# EAGLE schematic relay_matrix_16x8 (EAGLE 9.5.1)

## Sheet 1 of 6
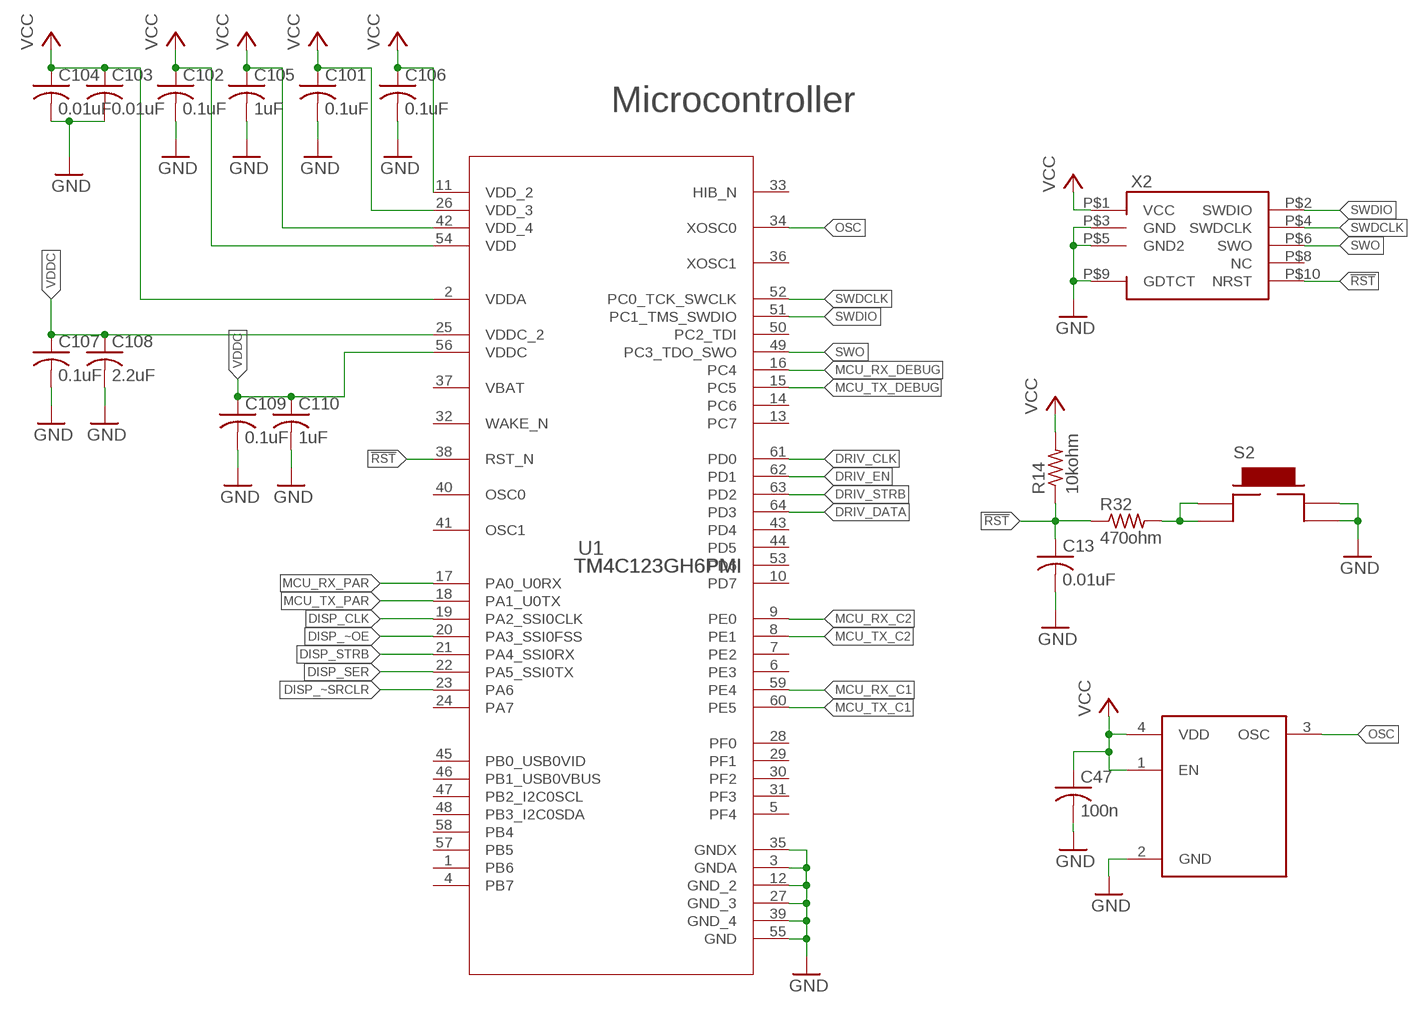
[diagram p0: schematic, sheet 1]

### Parts
C13  0.01uF  C-USC0402  [C0402]
C47  100n  C-USC0402  [C0402]
C101  0.1uF  C-USC0402  [C0402]
C102  0.1uF  C-USC0402  [C0402]
C103  0.01uF  C-USC0402  [C0402]
C104  0.01uF  C-USC0402  [C0402]
C105  1uF  C-USC0402  [C0402]
C106  0.1uF  C-USC0402  [C0402]
C107  0.1uF  C-USC0402  [C0402]
C108  2.2uF  C-USC0603  [C0603]
C109  0.1uF  C-USC0402  [C0402]
C110  1uF  C-USC0402  [C0402]
R14  10kohm  R-US_R0402  [R0402]
R32  470ohm  R-US_R0402  [R0402]
S2  TE_FSM4JSMA  [TE_FSMJSMA]
U1  TM4C123GH6PMI  [PM0064A_N]
U5  ECS-2033-080-AU  [OSCCC250X200X110N]
X2  FTSH-105-01-F-DV-007-K-P  [FTSH-105-01-F-DV-007-K-P]

### Nets
!RST: C13.1 R14.1 R32.1 U1.38(RST_N) X2.P$10(NRST)
DISP_CLK: U1.19(PA2_SSI0CLK) ; also sheet 5
DISP_SER: U1.22(PA5_SSI0TX) ; also sheet 5
DISP_STRB: U1.21(PA4_SSI0RX) ; also sheet 5
DISP_~OE: U1.20(PA3_SSI0FSS) ; also sheet 5
DISP_~SRCLR: U1.23(PA6) ; also sheet 5
DRIV_CLK: U1.61(PD0) ; also sheet 3
DRIV_DATA: U1.64(PD3) ; also sheet 3
DRIV_EN: U1.62(PD1) ; also sheet 3
DRIV_STRB: U1.63(PD2) ; also sheet 3
GND: C13.2 C47.2 C101.2 C102.2 C103.2 C104.2 C105.2 C106.2 C107.2 C108.2 C109.2 C110.2 S2.P$3 S2.P$4 U1.3(GNDA) U1.12(GND_2) U1.27(GND_3) U1.35(GNDX) U1.39(GND_4) U1.55(GND) U5.2(GND) X2.P$3(GND) X2.P$5(GND2) X2.P$9(GDTCT) ; also sheet 2,3,4,5
MCU_RX_C1: U1.59(PE4) ; also sheet 2
MCU_RX_C2: U1.9(PE0) ; also sheet 2
MCU_RX_DEBUG: U1.16(PC4) ; also sheet 2
MCU_RX_PAR: U1.17(PA0_U0RX) ; also sheet 2
MCU_TX_C1: U1.60(PE5) ; also sheet 2
MCU_TX_C2: U1.8(PE1) ; also sheet 2
MCU_TX_DEBUG: U1.15(PC5) ; also sheet 2
MCU_TX_PAR: U1.18(PA1_U0TX) ; also sheet 2
N$19: R32.2 S2.P$1 S2.P$2
OSC: U1.34(XOSC0) U5.3(OSC)
SWDCLK: U1.52(PC0_TCK_SWCLK) X2.P$4(SWDCLK)
SWDIO: U1.51(PC1_TMS_SWDIO) X2.P$2(SWDIO)
SWO: U1.49(PC3_TDO_SWO) X2.P$6(SWO)
VCC: C47.1 C101.1 C102.1 C103.1 C104.1 C105.1 C106.1 R14.2 U1.2(VDDA) U1.11(VDD_2) U1.26(VDD_3) U1.42(VDD_4) U1.54(VDD) U5.1(EN) U5.4(VDD) X2.P$1(VCC) ; also sheet 2,3,5
VDDC: C107.1 C108.1 C109.1 C110.1 U1.25(VDDC_2) U1.56(VDDC)
Unconnected: U1.1(PB6) U1.4(PB7) U1.5(PF4) U1.6(PE3) U1.7(PE2) U1.10(PD7) U1.13(PC7) U1.14(PC6) U1.24(PA7) U1.28(PF0) U1.29(PF1) U1.30(PF2) U1.31(PF3) U1.32(WAKE_N) U1.33(HIB_N) U1.36(XOSC1) U1.40(OSC0) U1.41(OSC1) U1.43(PD4) U1.44(PD5) U1.45(PB0_USB0VID) U1.46(PB1_USB0VBUS) U1.47(PB2_I2C0SCL) U1.48(PB3_I2C0SDA) U1.50(PC2_TDI) U1.53(PD6) U1.57(PB5) U1.58(PB4) X2.P$8(NC)

### Notes on the sheet
- Microcontroller

## Sheet 2 of 6
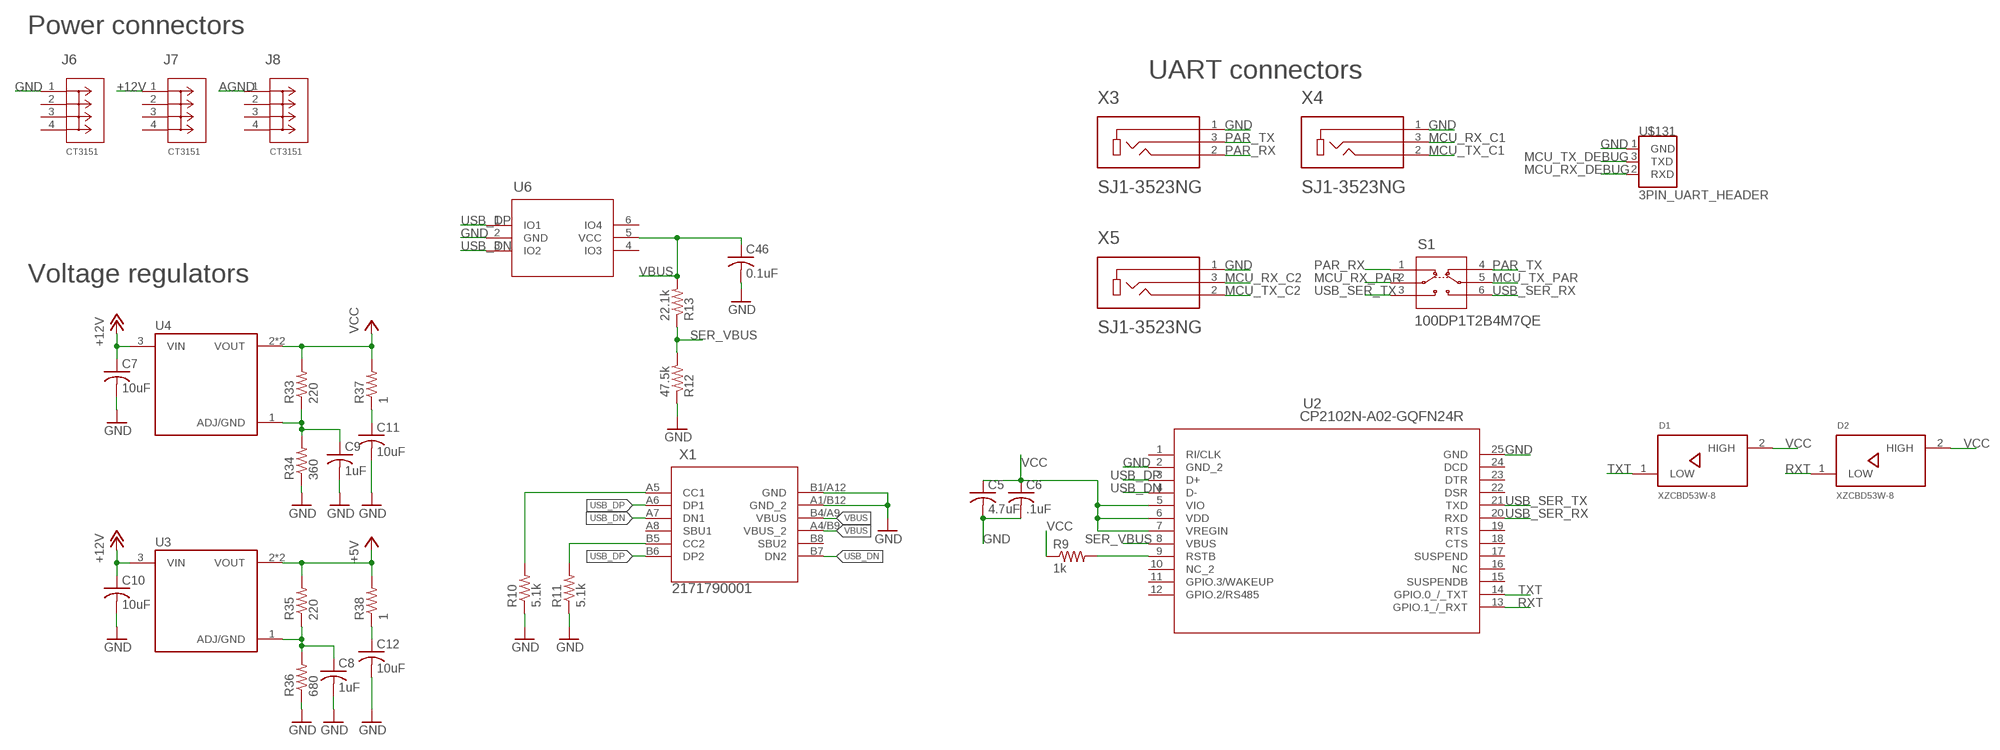
[diagram p1: schematic, sheet 2]

### Parts
C5  4.7uF  C-USC0603  [C0603]
C6  .1uF  C-USC0402  [C0402]
C7  10uF  C-USC0805  [C0805]
C8  1uF  C-USC0402  [C0402]
C9  1uF  C-USC0402  [C0402]
C10  10uF  C-USC0805  [C0805]
C11  10uF  C-USC0805  [C0805]
C12  10uF  C-USC0805  [C0805]
C46  0.1uF  C-USC0402  [C0402]
D1  XZCBD53W-8  [DIOC1608X70N]
D2  XZCBD53W-8  [DIOC1608X70N]
J6  CT3151  [CONN_CT3151]
J7  CT3151  [CONN_CT3151]
J8  CT3151  [CONN_CT3151]
R9  1k  R-US_R0402  [R0402]
R10  5.1k  R-US_R0402  [R0402]
R11  5.1k  R-US_R0402  [R0402]
R12  47.5k  R-US_R0402  [R0402]
R13  22.1k  R-US_R0402  [R0402]
R33  220  R-US_R0603  [R0603]
R34  360  R-US_R0603  [R0603]
R35  220  R-US_R0603  [R0603]
R36  680  R-US_R0603  [R0603]
R37  1  R-US_R0603  [R0603]
R38  1  R-US_R0603  [R0603]
S1  100DP1T2B4M7QE  [100DP1T2B4M7QE_EWI]
U2  CP2102N-A02-GQFN24R  [QFN24_SIL]
U3  NCP1117XXA  [TO230P990X240-4N]
U4  NCP1117XXA  [TO230P990X240-4N]
U6  TPD4E001RDBVR  [DBV6]
U$131  3PIN_UART_HEADER  [HDRV3W64P254_1X3_1016X277X854B]
X1  2171790001  [2171790001_MOL]
X3  SJ1-3523NG  [CUI_SJ1-3523NG]
X4  SJ1-3523NG  [CUI_SJ1-3523NG]
X5  SJ1-3523NG  [CUI_SJ1-3523NG]

### Nets
+5V: R35.2 R38.2 U3.2(VOUT) U3.4(VOUT) ; also sheet 3
+12V: C7.1 C10.1 J7.1 U3.3(VIN) U4.3(VIN)
AGND: J8.1 ; also sheet 6
GND: C5.2 C6.2 C7.2 C8.2 C9.2 C10.2 C11.2 C12.2 C46.2 J6.1 R10.1 R11.1 R12.1 R34.1 R36.1 U2.2(GND_2) U2.25(GND) U6.2(GND) U$131.1(GND) X1.A1/B12(GND_2) X1.B1/A12(GND) X3.1 X4.1 X5.1 ; also sheet 1,3,4,5
MCU_RX_C1: X4.3 ; also sheet 1
MCU_RX_C2: X5.3 ; also sheet 1
MCU_RX_DEBUG: U$131.2(RXD) ; also sheet 1
MCU_RX_PAR: S1.2 ; also sheet 1
MCU_TX_C1: X4.2 ; also sheet 1
MCU_TX_C2: X5.2 ; also sheet 1
MCU_TX_DEBUG: U$131.3(TXD) ; also sheet 1
MCU_TX_PAR: S1.5 ; also sheet 1
N$1: R9.2 U2.9(RSTB)
N$4: R10.2 X1.A5(CC1)
N$5: R11.2 X1.B5(CC2)
N$20: C9.1 R33.1 R34.2 U4.1(ADJ/GND)
N$21: C8.1 R35.1 R36.2 U3.1(ADJ/GND)
N$22: C11.1 R37.1
N$23: C12.1 R38.1
PAR_RX: S1.1 X3.2
PAR_TX: S1.4 X3.3
RXT: D2.1(LOW) U2.13(GPIO.1_/_RXT)
SER_VBUS: R12.2 R13.1 U2.8(VBUS)
TXT: D1.1(LOW) U2.14(GPIO.0_/_TXT)
USB_DN: U2.4(D-) U6.3(IO2) X1.A7(DN1) X1.B7(DN2)
USB_DP: U2.3(D+) U6.1(IO1) X1.A6(DP1) X1.B6(DP2)
USB_SER_RX: S1.6 U2.20(RXD)
USB_SER_TX: S1.3 U2.21(TXD)
VBUS: C46.1 R13.2 U6.5(VCC) X1.A4/B9(VBUS_2) X1.B4/A9(VBUS)
VCC: C5.1 C6.1 D1.2(HIGH) D2.2(HIGH) R9.1 R33.2 R37.2 U2.5(VIO) U2.6(VDD) U2.7(VREGIN) U4.2(VOUT) U4.4(VOUT) ; also sheet 1,3,5
Unconnected: J6.2 J6.3 J6.4 J7.2 J7.3 J7.4 J8.2 J8.3 J8.4 U2.1(RI/CLK) U2.10(NC_2) U2.11(GPIO.3/WAKEUP) U2.12(GPIO.2/RS485) U2.15(SUSPENDB) U2.16(NC) U2.17(SUSPEND) U2.18(CTS) U2.19(RTS) U2.22(DSR) U2.23(DTR) U2.24(DCD) U6.4(IO3) U6.6(IO4) X1.A8(SBU1) X1.B8(SBU2)

### Notes on the sheet
- Power connectors
- UART connectors
- Voltage regulators

## Sheet 3 of 6
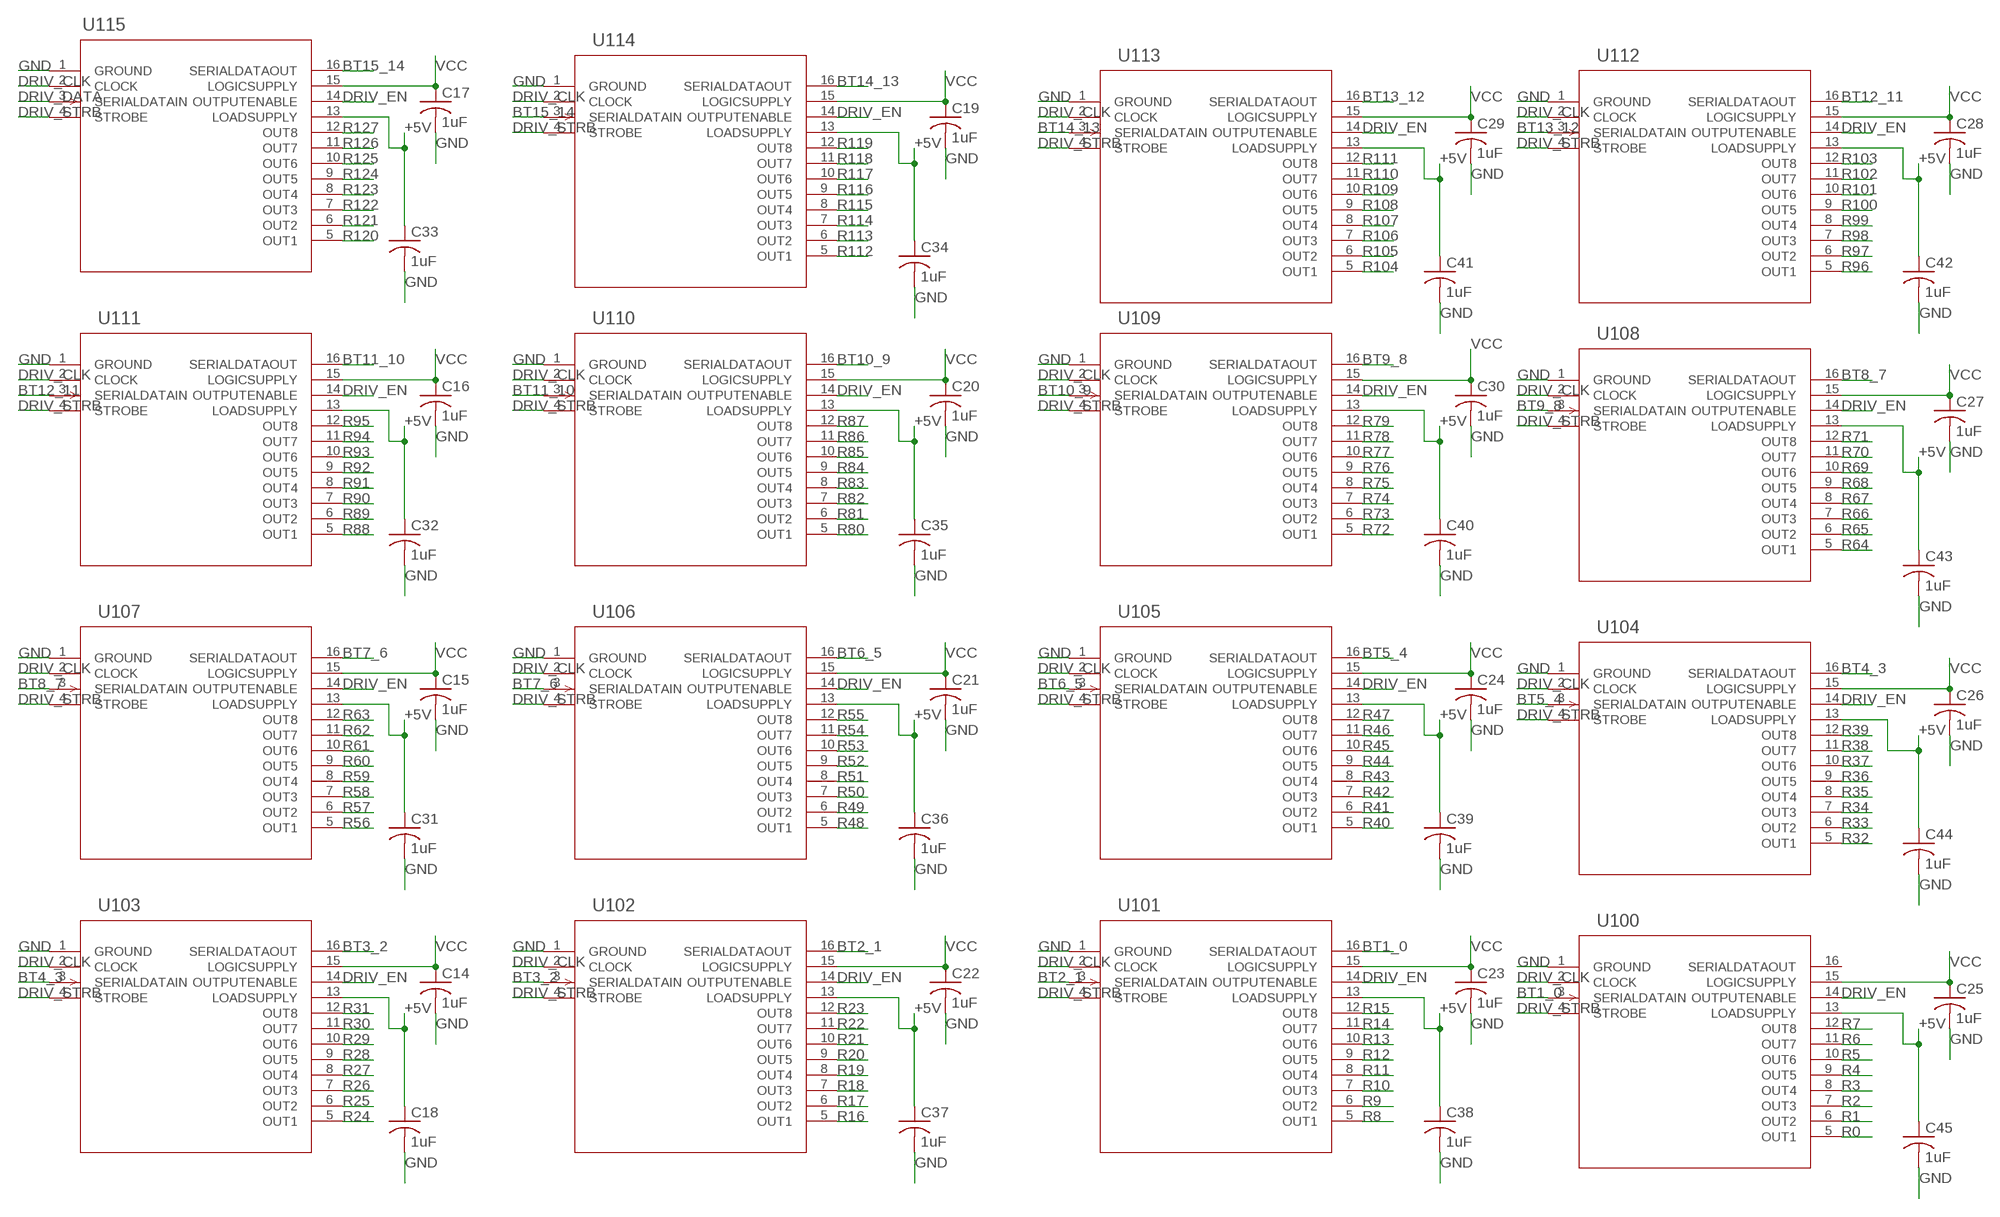
[diagram p2: schematic, sheet 3]

### Parts
C14  1uF  C-USC0402  [C0402]
C15  1uF  C-USC0402  [C0402]
C16  1uF  C-USC0402  [C0402]
C17  1uF  C-USC0402  [C0402]
C18  1uF  C-USC0402  [C0402]
C19  1uF  C-USC0402  [C0402]
C20  1uF  C-USC0402  [C0402]
C21  1uF  C-USC0402  [C0402]
C22  1uF  C-USC0402  [C0402]
C23  1uF  C-USC0402  [C0402]
C24  1uF  C-USC0402  [C0402]
C25  1uF  C-USC0402  [C0402]
C26  1uF  C-USC0402  [C0402]
C27  1uF  C-USC0402  [C0402]
C28  1uF  C-USC0402  [C0402]
C29  1uF  C-USC0402  [C0402]
C30  1uF  C-USC0402  [C0402]
C31  1uF  C-USC0402  [C0402]
C32  1uF  C-USC0402  [C0402]
C33  1uF  C-USC0402  [C0402]
C34  1uF  C-USC0402  [C0402]
C35  1uF  C-USC0402  [C0402]
C36  1uF  C-USC0402  [C0402]
C37  1uF  C-USC0402  [C0402]
C38  1uF  C-USC0402  [C0402]
C39  1uF  C-USC0402  [C0402]
C40  1uF  C-USC0402  [C0402]
C41  1uF  C-USC0402  [C0402]
C42  1uF  C-USC0402  [C0402]
C43  1uF  C-USC0402  [C0402]
C44  1uF  C-USC0402  [C0402]
C45  1uF  C-USC0402  [C0402]
U100  MIC5891YWM-TR  [SOIC-16_WM_MCH]
U101  MIC5891YWM-TR  [SOIC-16_WM_MCH]
U102  MIC5891YWM-TR  [SOIC-16_WM_MCH]
U103  MIC5891YWM-TR  [SOIC-16_WM_MCH]
U104  MIC5891YWM-TR  [SOIC-16_WM_MCH]
U105  MIC5891YWM-TR  [SOIC-16_WM_MCH]
U106  MIC5891YWM-TR  [SOIC-16_WM_MCH]
U107  MIC5891YWM-TR  [SOIC-16_WM_MCH]
U108  MIC5891YWM-TR  [SOIC-16_WM_MCH]
U109  MIC5891YWM-TR  [SOIC-16_WM_MCH]
U110  MIC5891YWM-TR  [SOIC-16_WM_MCH]
U111  MIC5891YWM-TR  [SOIC-16_WM_MCH]
U112  MIC5891YWM-TR  [SOIC-16_WM_MCH]
U113  MIC5891YWM-TR  [SOIC-16_WM_MCH]
U114  MIC5891YWM-TR  [SOIC-16_WM_MCH]
U115  MIC5891YWM-TR  [SOIC-16_WM_MCH]

### Nets
+5V: C18.1 C31.1 C32.1 C33.1 C34.1 C35.1 C36.1 C37.1 C38.1 C39.1 C40.1 C41.1 C42.1 C43.1 C44.1 C45.1 U100.13(LOADSUPPLY) U101.13(LOADSUPPLY) U102.13(LOADSUPPLY) U103.13(LOADSUPPLY) U104.13(LOADSUPPLY) U105.13(LOADSUPPLY) U106.13(LOADSUPPLY) U107.13(LOADSUPPLY) U108.13(LOADSUPPLY) U109.13(LOADSUPPLY) U110.13(LOADSUPPLY) U111.13(LOADSUPPLY) U112.13(LOADSUPPLY) U113.13(LOADSUPPLY) U114.13(LOADSUPPLY) U115.13(LOADSUPPLY) ; also sheet 2
BT1_0: U100.3(SERIALDATAIN) U101.16(SERIALDATAOUT)
BT2_1: U101.3(SERIALDATAIN) U102.16(SERIALDATAOUT)
BT3_2: U102.3(SERIALDATAIN) U103.16(SERIALDATAOUT)
BT4_3: U103.3(SERIALDATAIN) U104.16(SERIALDATAOUT)
BT5_4: U104.3(SERIALDATAIN) U105.16(SERIALDATAOUT)
BT6_5: U105.3(SERIALDATAIN) U106.16(SERIALDATAOUT)
BT7_6: U106.3(SERIALDATAIN) U107.16(SERIALDATAOUT)
BT8_7: U107.3(SERIALDATAIN) U108.16(SERIALDATAOUT)
BT9_8: U108.3(SERIALDATAIN) U109.16(SERIALDATAOUT)
BT10_9: U109.3(SERIALDATAIN) U110.16(SERIALDATAOUT)
BT11_10: U110.3(SERIALDATAIN) U111.16(SERIALDATAOUT)
BT12_11: U111.3(SERIALDATAIN) U112.16(SERIALDATAOUT)
BT13_12: U112.3(SERIALDATAIN) U113.16(SERIALDATAOUT)
BT14_13: U113.3(SERIALDATAIN) U114.16(SERIALDATAOUT)
BT15_14: U114.3(SERIALDATAIN) U115.16(SERIALDATAOUT)
DRIV_CLK: U100.2(CLOCK) U101.2(CLOCK) U102.2(CLOCK) U103.2(CLOCK) U104.2(CLOCK) U105.2(CLOCK) U106.2(CLOCK) U107.2(CLOCK) U108.2(CLOCK) U109.2(CLOCK) U110.2(CLOCK) U111.2(CLOCK) U112.2(CLOCK) U113.2(CLOCK) U114.2(CLOCK) U115.2(CLOCK) ; also sheet 1
DRIV_DATA: U115.3(SERIALDATAIN) ; also sheet 1
DRIV_EN: U100.14(OUTPUTENABLE) U101.14(OUTPUTENABLE) U102.14(OUTPUTENABLE) U103.14(OUTPUTENABLE) U104.14(OUTPUTENABLE) U105.14(OUTPUTENABLE) U106.14(OUTPUTENABLE) U107.14(OUTPUTENABLE) U108.14(OUTPUTENABLE) U109.14(OUTPUTENABLE) U110.14(OUTPUTENABLE) U111.14(OUTPUTENABLE) U112.14(OUTPUTENABLE) U113.14(OUTPUTENABLE) U114.14(OUTPUTENABLE) U115.14(OUTPUTENABLE) ; also sheet 1
DRIV_STRB: U100.4(STROBE) U101.4(STROBE) U102.4(STROBE) U103.4(STROBE) U104.4(STROBE) U105.4(STROBE) U106.4(STROBE) U107.4(STROBE) U108.4(STROBE) U109.4(STROBE) U110.4(STROBE) U111.4(STROBE) U112.4(STROBE) U113.4(STROBE) U114.4(STROBE) U115.4(STROBE) ; also sheet 1
GND: C14.2 C15.2 C16.2 C17.2 C18.2 C19.2 C20.2 C21.2 C22.2 C23.2 C24.2 C25.2 C26.2 C27.2 C28.2 C29.2 C30.2 C31.2 C32.2 C33.2 C34.2 C35.2 C36.2 C37.2 C38.2 C39.2 C40.2 C41.2 C42.2 C43.2 C44.2 C45.2 U100.1(GROUND) U101.1(GROUND) U102.1(GROUND) U103.1(GROUND) U104.1(GROUND) U105.1(GROUND) U106.1(GROUND) U107.1(GROUND) U108.1(GROUND) U109.1(GROUND) U110.1(GROUND) U111.1(GROUND) U112.1(GROUND) U113.1(GROUND) U114.1(GROUND) U115.1(GROUND) ; also sheet 1,2,4,5
R0: U100.5(OUT1) ; also sheet 4
R1: U100.6(OUT2) ; also sheet 4
R2: U100.7(OUT3) ; also sheet 4
R3: U100.8(OUT4) ; also sheet 4
R4: U100.9(OUT5) ; also sheet 4
R5: U100.10(OUT6) ; also sheet 4
R6: U100.11(OUT7) ; also sheet 4
R7: U100.12(OUT8) ; also sheet 4
R8: U101.5(OUT1) ; also sheet 4
R9: U101.6(OUT2) ; also sheet 4
R10: U101.7(OUT3) ; also sheet 4
R11: U101.8(OUT4) ; also sheet 4
R12: U101.9(OUT5) ; also sheet 4
R13: U101.10(OUT6) ; also sheet 4
R14: U101.11(OUT7) ; also sheet 4
R15: U101.12(OUT8) ; also sheet 4
R16: U102.5(OUT1) ; also sheet 4
R17: U102.6(OUT2) ; also sheet 4
R18: U102.7(OUT3) ; also sheet 4
R19: U102.8(OUT4) ; also sheet 4
R20: U102.9(OUT5) ; also sheet 4
R21: U102.10(OUT6) ; also sheet 4
R22: U102.11(OUT7) ; also sheet 4
R23: U102.12(OUT8) ; also sheet 4
R24: U103.5(OUT1) ; also sheet 4
R25: U103.6(OUT2) ; also sheet 4
R26: U103.7(OUT3) ; also sheet 4
R27: U103.8(OUT4) ; also sheet 4
R28: U103.9(OUT5) ; also sheet 4
R29: U103.10(OUT6) ; also sheet 4
R30: U103.11(OUT7) ; also sheet 4
R31: U103.12(OUT8) ; also sheet 4
R32: U104.5(OUT1) ; also sheet 4
R33: U104.6(OUT2) ; also sheet 4
R34: U104.7(OUT3) ; also sheet 4
R35: U104.8(OUT4) ; also sheet 4
R36: U104.9(OUT5) ; also sheet 4
R37: U104.10(OUT6) ; also sheet 4
R38: U104.11(OUT7) ; also sheet 4
R39: U104.12(OUT8) ; also sheet 4
R40: U105.5(OUT1) ; also sheet 4
R41: U105.6(OUT2) ; also sheet 4
R42: U105.7(OUT3) ; also sheet 4
R43: U105.8(OUT4) ; also sheet 4
R44: U105.9(OUT5) ; also sheet 4
R45: U105.10(OUT6) ; also sheet 4
R46: U105.11(OUT7) ; also sheet 4
R47: U105.12(OUT8) ; also sheet 4
R48: U106.5(OUT1) ; also sheet 4
R49: U106.6(OUT2) ; also sheet 4
R50: U106.7(OUT3) ; also sheet 4
R51: U106.8(OUT4) ; also sheet 4
R52: U106.9(OUT5) ; also sheet 4
R53: U106.10(OUT6) ; also sheet 4
R54: U106.11(OUT7) ; also sheet 4
R55: U106.12(OUT8) ; also sheet 4
R56: U107.5(OUT1) ; also sheet 4
R57: U107.6(OUT2) ; also sheet 4
R58: U107.7(OUT3) ; also sheet 4
R59: U107.8(OUT4) ; also sheet 4
R60: U107.9(OUT5) ; also sheet 4
R61: U107.10(OUT6) ; also sheet 4
R62: U107.11(OUT7) ; also sheet 4
R63: U107.12(OUT8) ; also sheet 4
R64: U108.5(OUT1) ; also sheet 4
R65: U108.6(OUT2) ; also sheet 4
R66: U108.7(OUT3) ; also sheet 4
R67: U108.8(OUT4) ; also sheet 4
R68: U108.9(OUT5) ; also sheet 4
R69: U108.10(OUT6) ; also sheet 4
R70: U108.11(OUT7) ; also sheet 4
R71: U108.12(OUT8) ; also sheet 4
R72: U109.5(OUT1) ; also sheet 4
R73: U109.6(OUT2) ; also sheet 4
R74: U109.7(OUT3) ; also sheet 4
R75: U109.8(OUT4) ; also sheet 4
R76: U109.9(OUT5) ; also sheet 4
R77: U109.10(OUT6) ; also sheet 4
R78: U109.11(OUT7) ; also sheet 4
R79: U109.12(OUT8) ; also sheet 4
R80: U110.5(OUT1) ; also sheet 4
R81: U110.6(OUT2) ; also sheet 4
R82: U110.7(OUT3) ; also sheet 4
R83: U110.8(OUT4) ; also sheet 4
R84: U110.9(OUT5) ; also sheet 4
R85: U110.10(OUT6) ; also sheet 4
R86: U110.11(OUT7) ; also sheet 4
R87: U110.12(OUT8) ; also sheet 4
R88: U111.5(OUT1) ; also sheet 4
R89: U111.6(OUT2) ; also sheet 4
R90: U111.7(OUT3) ; also sheet 4
R91: U111.8(OUT4) ; also sheet 4
R92: U111.9(OUT5) ; also sheet 4
R93: U111.10(OUT6) ; also sheet 4
R94: U111.11(OUT7) ; also sheet 4
R95: U111.12(OUT8) ; also sheet 4
R96: U112.5(OUT1) ; also sheet 4
R97: U112.6(OUT2) ; also sheet 4
R98: U112.7(OUT3) ; also sheet 4
R99: U112.8(OUT4) ; also sheet 4
R100: U112.9(OUT5) ; also sheet 4
R101: U112.10(OUT6) ; also sheet 4
R102: U112.11(OUT7) ; also sheet 4
R103: U112.12(OUT8) ; also sheet 4
R104: U113.5(OUT1) ; also sheet 4
R105: U113.6(OUT2) ; also sheet 4
R106: U113.7(OUT3) ; also sheet 4
R107: U113.8(OUT4) ; also sheet 4
R108: U113.9(OUT5) ; also sheet 4
R109: U113.10(OUT6) ; also sheet 4
R110: U113.11(OUT7) ; also sheet 4
R111: U113.12(OUT8) ; also sheet 4
R112: U114.5(OUT1) ; also sheet 4
R113: U114.6(OUT2) ; also sheet 4
R114: U114.7(OUT3) ; also sheet 4
R115: U114.8(OUT4) ; also sheet 4
R116: U114.9(OUT5) ; also sheet 4
R117: U114.10(OUT6) ; also sheet 4
R118: U114.11(OUT7) ; also sheet 4
R119: U114.12(OUT8) ; also sheet 4
R120: U115.5(OUT1) ; also sheet 4
R121: U115.6(OUT2) ; also sheet 4
R122: U115.7(OUT3) ; also sheet 4
R123: U115.8(OUT4) ; also sheet 4
R124: U115.9(OUT5) ; also sheet 4
R125: U115.10(OUT6) ; also sheet 4
R126: U115.11(OUT7) ; also sheet 4
R127: U115.12(OUT8) ; also sheet 4
VCC: C14.1 C15.1 C16.1 C17.1 C19.1 C20.1 C21.1 C22.1 C23.1 C24.1 C25.1 C26.1 C27.1 C28.1 C29.1 C30.1 U100.15(LOGICSUPPLY) U101.15(LOGICSUPPLY) U102.15(LOGICSUPPLY) U103.15(LOGICSUPPLY) U104.15(LOGICSUPPLY) U105.15(LOGICSUPPLY) U106.15(LOGICSUPPLY) U107.15(LOGICSUPPLY) U108.15(LOGICSUPPLY) U109.15(LOGICSUPPLY) U110.15(LOGICSUPPLY) U111.15(LOGICSUPPLY) U112.15(LOGICSUPPLY) U113.15(LOGICSUPPLY) U114.15(LOGICSUPPLY) U115.15(LOGICSUPPLY) ; also sheet 1,2,5
Unconnected: U100.16(SERIALDATAOUT)

## Sheet 4 of 6
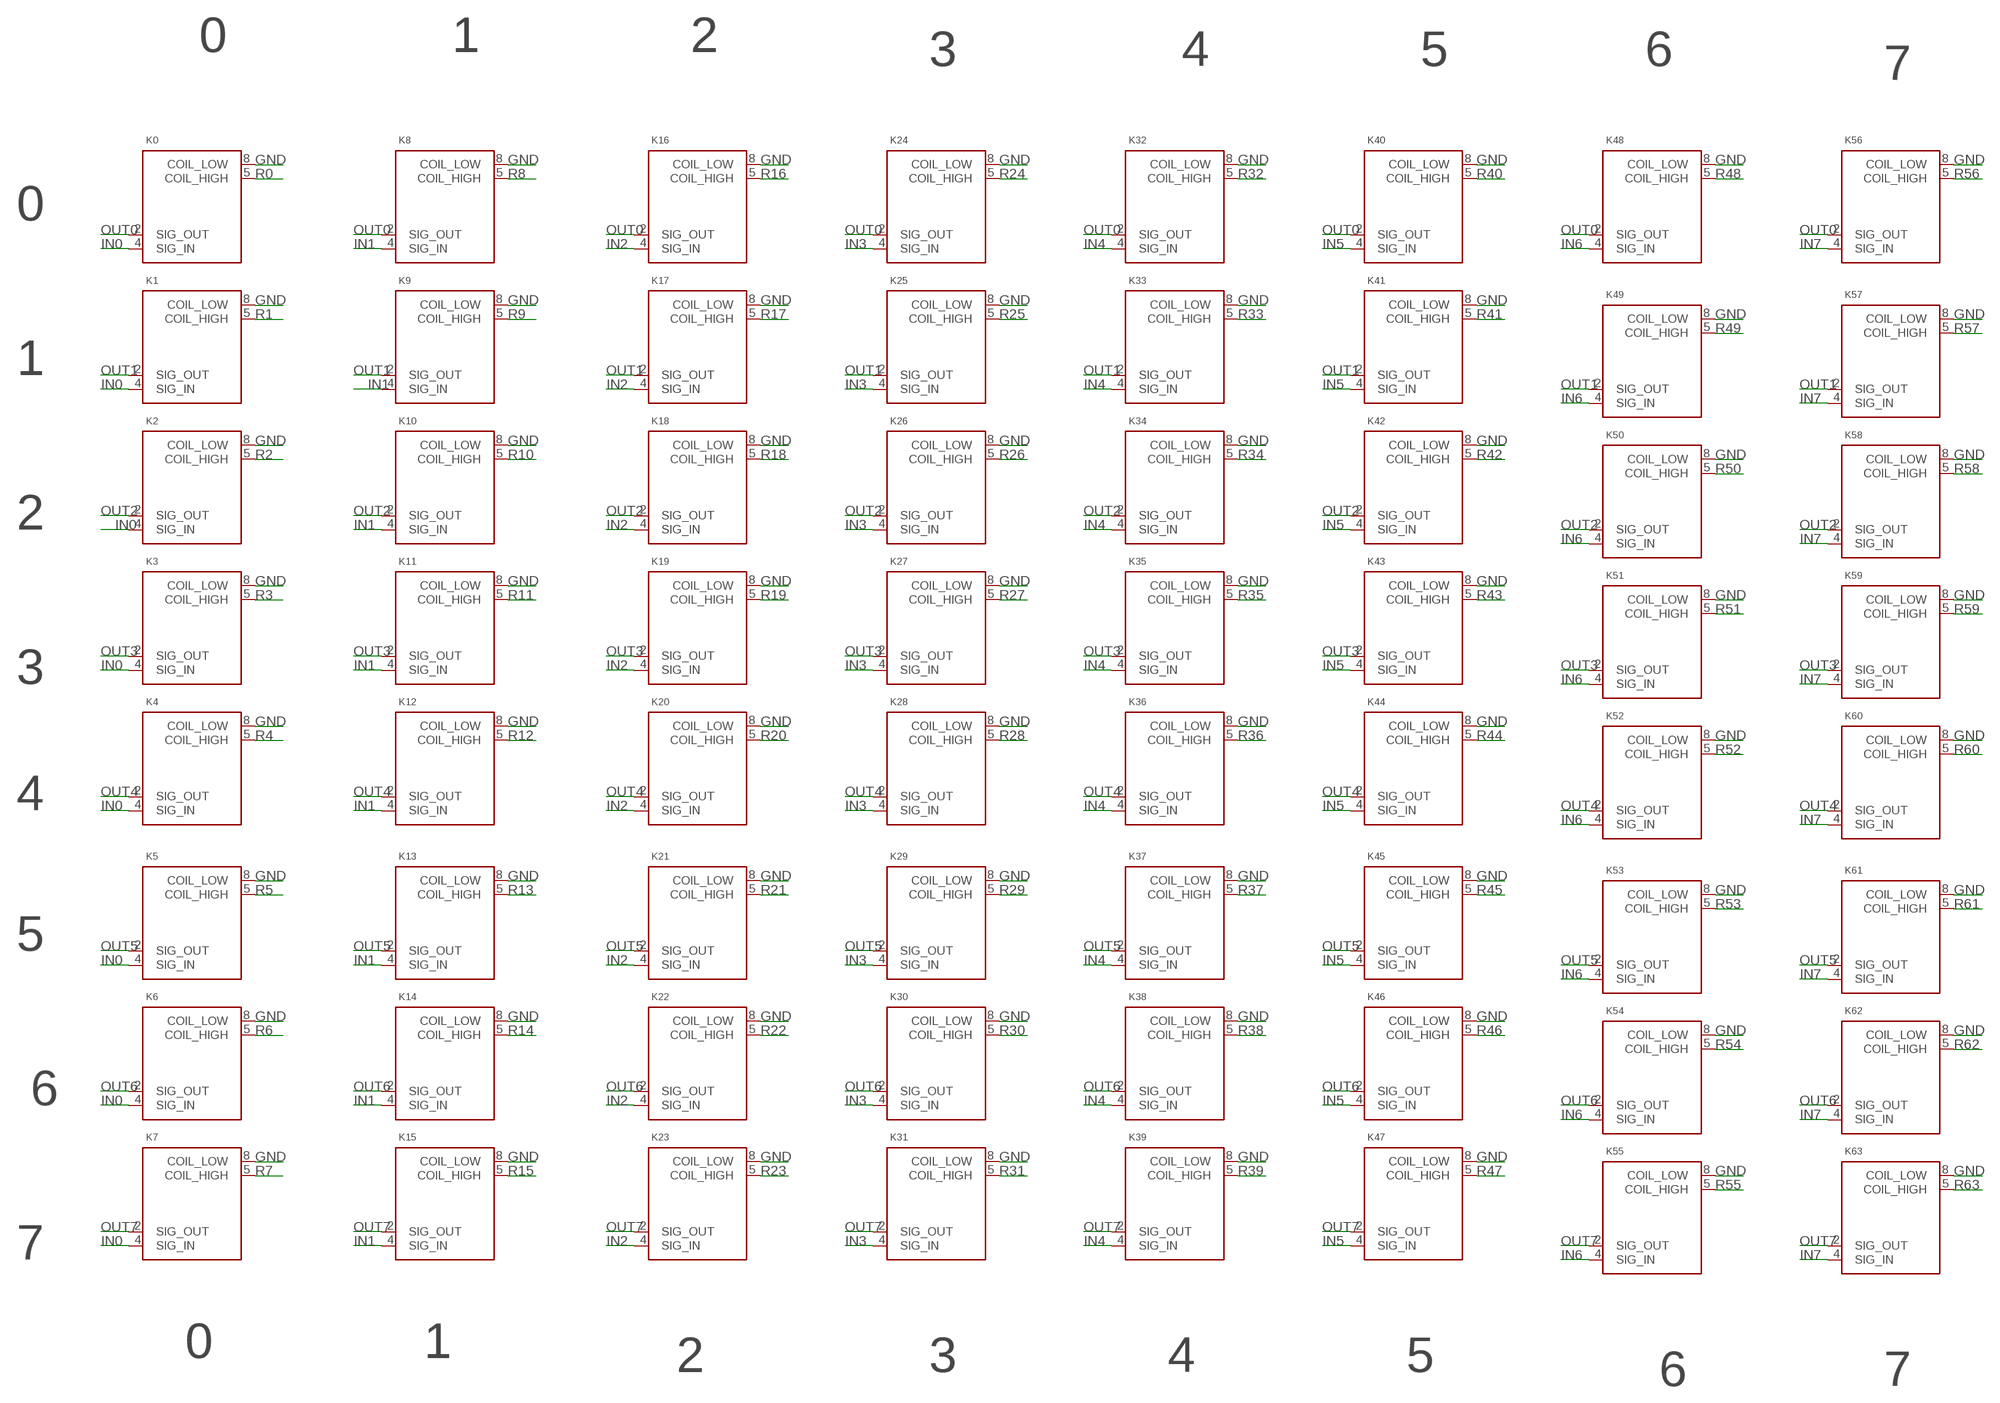
[diagram p3: schematic, sheet 4, part 1 of 2]
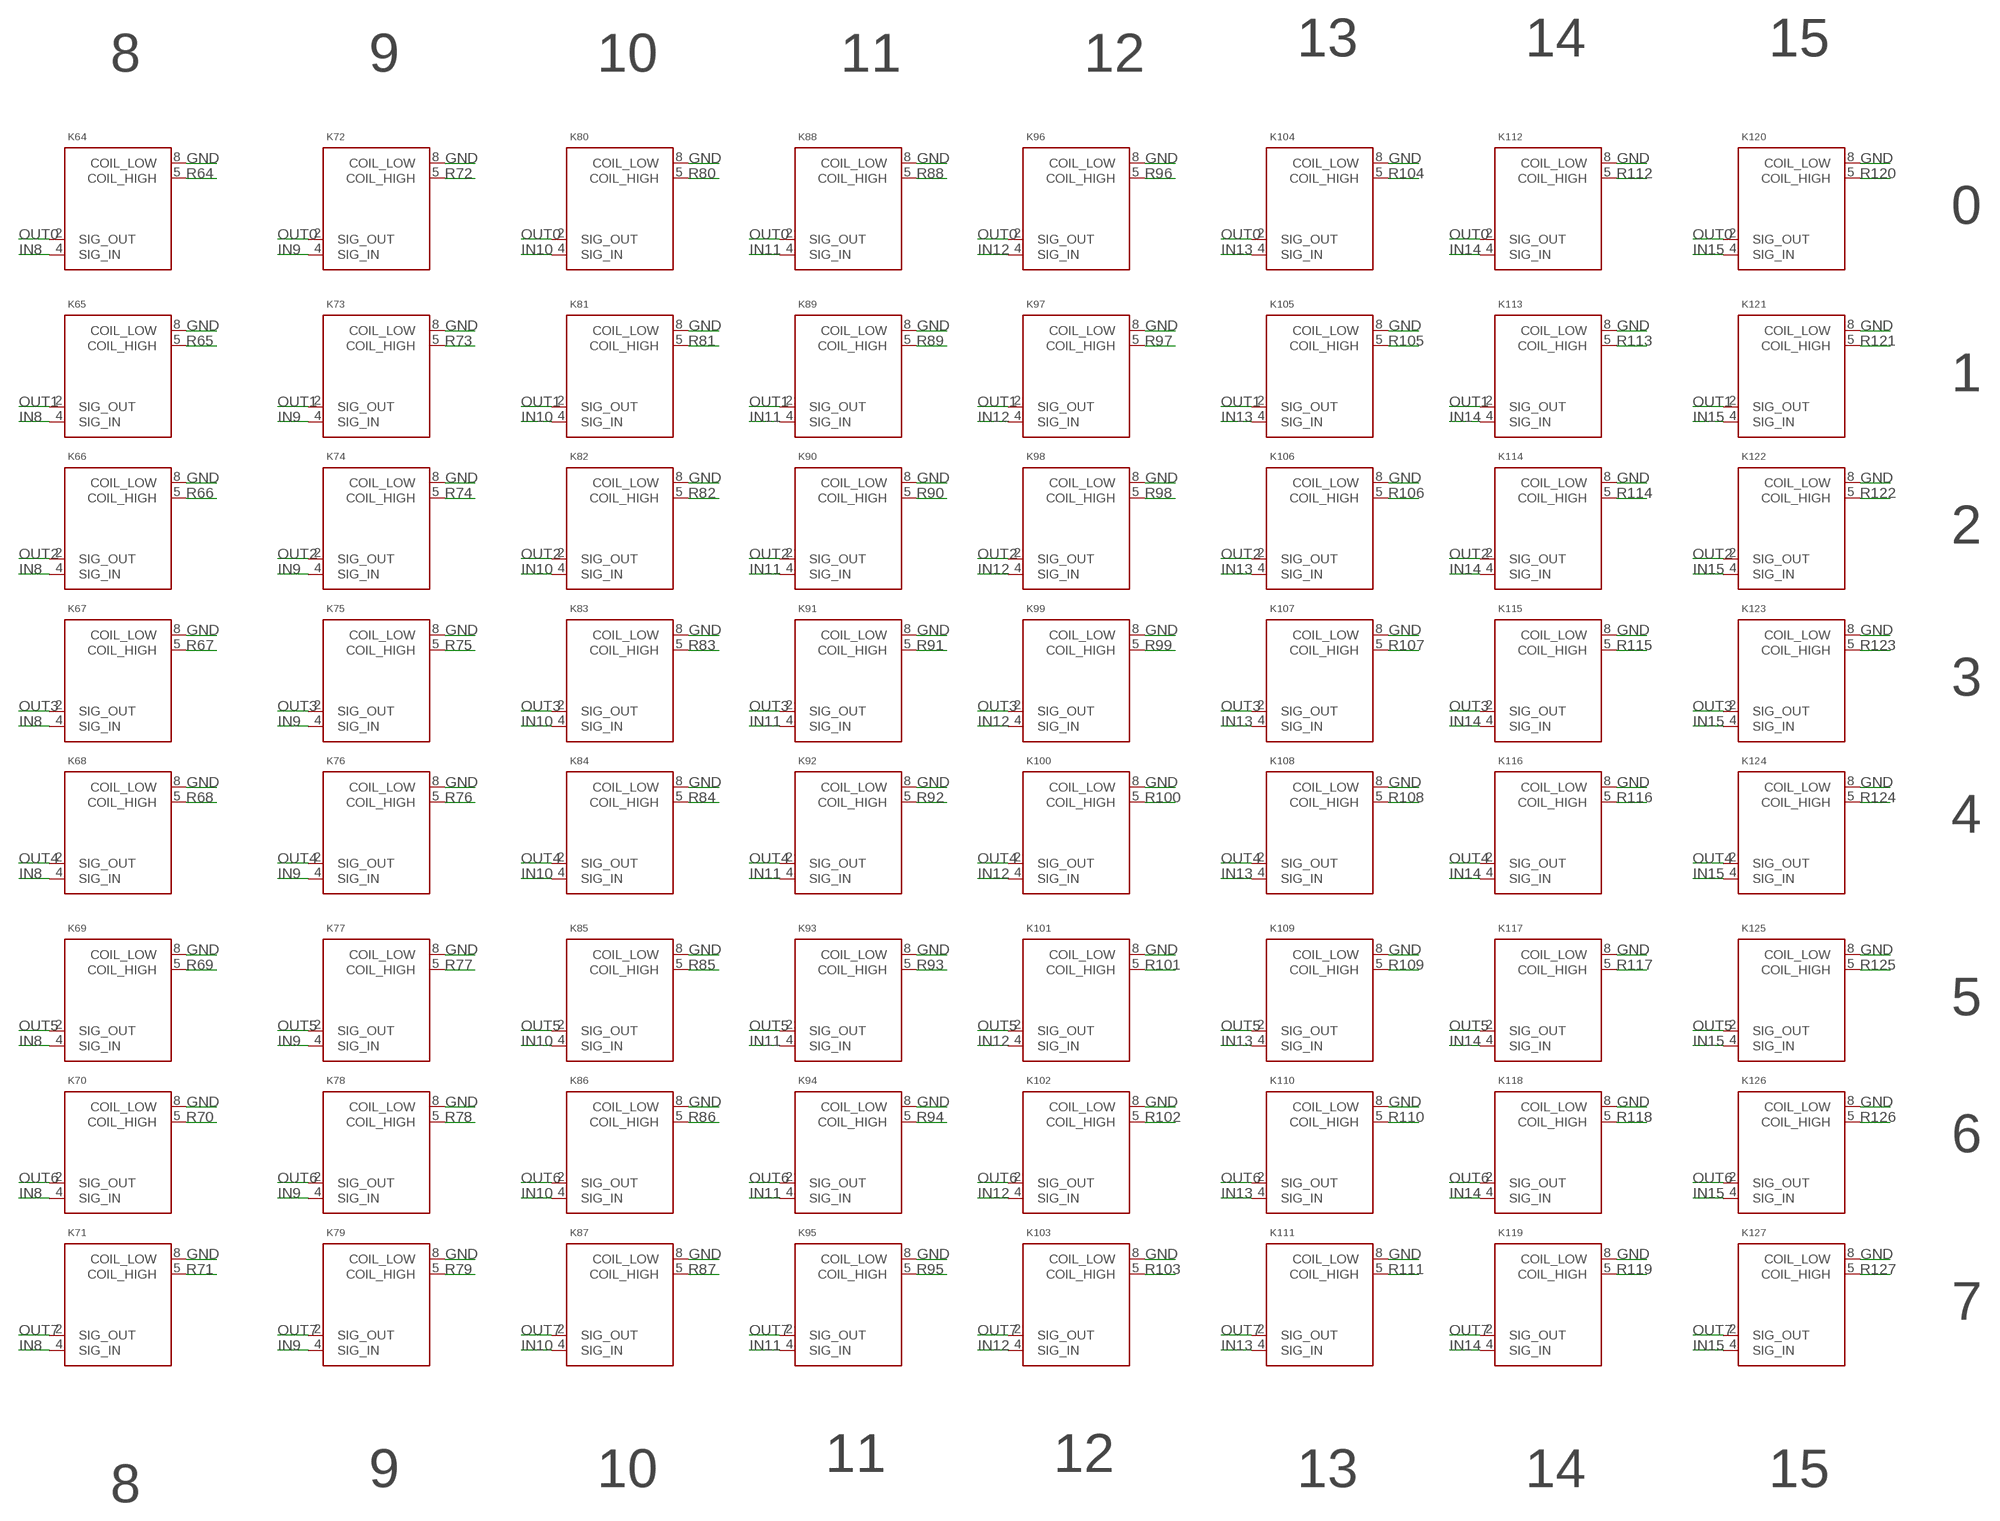
[diagram p4: schematic, sheet 4, part 2 of 2]

### Parts
K0  G6L-1F-DC4.5  [G6L-1F-DC4.5]
K1  G6L-1F-DC4.5  [G6L-1F-DC4.5]
K2  G6L-1F-DC4.5  [G6L-1F-DC4.5]
K3  G6L-1F-DC4.5  [G6L-1F-DC4.5]
K4  G6L-1F-DC4.5  [G6L-1F-DC4.5]
K5  G6L-1F-DC4.5  [G6L-1F-DC4.5]
K6  G6L-1F-DC4.5  [G6L-1F-DC4.5]
K7  G6L-1F-DC4.5  [G6L-1F-DC4.5]
K8  G6L-1F-DC4.5  [G6L-1F-DC4.5]
K9  G6L-1F-DC4.5  [G6L-1F-DC4.5]
K10  G6L-1F-DC4.5  [G6L-1F-DC4.5]
K11  G6L-1F-DC4.5  [G6L-1F-DC4.5]
K12  G6L-1F-DC4.5  [G6L-1F-DC4.5]
K13  G6L-1F-DC4.5  [G6L-1F-DC4.5]
K14  G6L-1F-DC4.5  [G6L-1F-DC4.5]
K15  G6L-1F-DC4.5  [G6L-1F-DC4.5]
K16  G6L-1F-DC4.5  [G6L-1F-DC4.5]
K17  G6L-1F-DC4.5  [G6L-1F-DC4.5]
K18  G6L-1F-DC4.5  [G6L-1F-DC4.5]
K19  G6L-1F-DC4.5  [G6L-1F-DC4.5]
K20  G6L-1F-DC4.5  [G6L-1F-DC4.5]
K21  G6L-1F-DC4.5  [G6L-1F-DC4.5]
K22  G6L-1F-DC4.5  [G6L-1F-DC4.5]
K23  G6L-1F-DC4.5  [G6L-1F-DC4.5]
K24  G6L-1F-DC4.5  [G6L-1F-DC4.5]
K25  G6L-1F-DC4.5  [G6L-1F-DC4.5]
K26  G6L-1F-DC4.5  [G6L-1F-DC4.5]
K27  G6L-1F-DC4.5  [G6L-1F-DC4.5]
K28  G6L-1F-DC4.5  [G6L-1F-DC4.5]
K29  G6L-1F-DC4.5  [G6L-1F-DC4.5]
K30  G6L-1F-DC4.5  [G6L-1F-DC4.5]
K31  G6L-1F-DC4.5  [G6L-1F-DC4.5]
K32  G6L-1F-DC4.5  [G6L-1F-DC4.5]
K33  G6L-1F-DC4.5  [G6L-1F-DC4.5]
K34  G6L-1F-DC4.5  [G6L-1F-DC4.5]
K35  G6L-1F-DC4.5  [G6L-1F-DC4.5]
K36  G6L-1F-DC4.5  [G6L-1F-DC4.5]
K37  G6L-1F-DC4.5  [G6L-1F-DC4.5]
K38  G6L-1F-DC4.5  [G6L-1F-DC4.5]
K39  G6L-1F-DC4.5  [G6L-1F-DC4.5]
K40  G6L-1F-DC4.5  [G6L-1F-DC4.5]
K41  G6L-1F-DC4.5  [G6L-1F-DC4.5]
K42  G6L-1F-DC4.5  [G6L-1F-DC4.5]
K43  G6L-1F-DC4.5  [G6L-1F-DC4.5]
K44  G6L-1F-DC4.5  [G6L-1F-DC4.5]
K45  G6L-1F-DC4.5  [G6L-1F-DC4.5]
K46  G6L-1F-DC4.5  [G6L-1F-DC4.5]
K47  G6L-1F-DC4.5  [G6L-1F-DC4.5]
K48  G6L-1F-DC4.5  [G6L-1F-DC4.5]
K49  G6L-1F-DC4.5  [G6L-1F-DC4.5]
K50  G6L-1F-DC4.5  [G6L-1F-DC4.5]
K51  G6L-1F-DC4.5  [G6L-1F-DC4.5]
K52  G6L-1F-DC4.5  [G6L-1F-DC4.5]
K53  G6L-1F-DC4.5  [G6L-1F-DC4.5]
K54  G6L-1F-DC4.5  [G6L-1F-DC4.5]
K55  G6L-1F-DC4.5  [G6L-1F-DC4.5]
K56  G6L-1F-DC4.5  [G6L-1F-DC4.5]
K57  G6L-1F-DC4.5  [G6L-1F-DC4.5]
K58  G6L-1F-DC4.5  [G6L-1F-DC4.5]
K59  G6L-1F-DC4.5  [G6L-1F-DC4.5]
K60  G6L-1F-DC4.5  [G6L-1F-DC4.5]
K61  G6L-1F-DC4.5  [G6L-1F-DC4.5]
K62  G6L-1F-DC4.5  [G6L-1F-DC4.5]
K63  G6L-1F-DC4.5  [G6L-1F-DC4.5]
K64  G6L-1F-DC4.5  [G6L-1F-DC4.5]
K65  G6L-1F-DC4.5  [G6L-1F-DC4.5]
K66  G6L-1F-DC4.5  [G6L-1F-DC4.5]
K67  G6L-1F-DC4.5  [G6L-1F-DC4.5]
K68  G6L-1F-DC4.5  [G6L-1F-DC4.5]
K69  G6L-1F-DC4.5  [G6L-1F-DC4.5]
K70  G6L-1F-DC4.5  [G6L-1F-DC4.5]
K71  G6L-1F-DC4.5  [G6L-1F-DC4.5]
K72  G6L-1F-DC4.5  [G6L-1F-DC4.5]
K73  G6L-1F-DC4.5  [G6L-1F-DC4.5]
K74  G6L-1F-DC4.5  [G6L-1F-DC4.5]
K75  G6L-1F-DC4.5  [G6L-1F-DC4.5]
K76  G6L-1F-DC4.5  [G6L-1F-DC4.5]
K77  G6L-1F-DC4.5  [G6L-1F-DC4.5]
K78  G6L-1F-DC4.5  [G6L-1F-DC4.5]
K79  G6L-1F-DC4.5  [G6L-1F-DC4.5]
K80  G6L-1F-DC4.5  [G6L-1F-DC4.5]
K81  G6L-1F-DC4.5  [G6L-1F-DC4.5]
K82  G6L-1F-DC4.5  [G6L-1F-DC4.5]
K83  G6L-1F-DC4.5  [G6L-1F-DC4.5]
K84  G6L-1F-DC4.5  [G6L-1F-DC4.5]
K85  G6L-1F-DC4.5  [G6L-1F-DC4.5]
K86  G6L-1F-DC4.5  [G6L-1F-DC4.5]
K87  G6L-1F-DC4.5  [G6L-1F-DC4.5]
K88  G6L-1F-DC4.5  [G6L-1F-DC4.5]
K89  G6L-1F-DC4.5  [G6L-1F-DC4.5]
K90  G6L-1F-DC4.5  [G6L-1F-DC4.5]
K91  G6L-1F-DC4.5  [G6L-1F-DC4.5]
K92  G6L-1F-DC4.5  [G6L-1F-DC4.5]
K93  G6L-1F-DC4.5  [G6L-1F-DC4.5]
K94  G6L-1F-DC4.5  [G6L-1F-DC4.5]
K95  G6L-1F-DC4.5  [G6L-1F-DC4.5]
K96  G6L-1F-DC4.5  [G6L-1F-DC4.5]
K97  G6L-1F-DC4.5  [G6L-1F-DC4.5]
K98  G6L-1F-DC4.5  [G6L-1F-DC4.5]
K99  G6L-1F-DC4.5  [G6L-1F-DC4.5]
K100  G6L-1F-DC4.5  [G6L-1F-DC4.5]
K101  G6L-1F-DC4.5  [G6L-1F-DC4.5]
K102  G6L-1F-DC4.5  [G6L-1F-DC4.5]
K103  G6L-1F-DC4.5  [G6L-1F-DC4.5]
K104  G6L-1F-DC4.5  [G6L-1F-DC4.5]
K105  G6L-1F-DC4.5  [G6L-1F-DC4.5]
K106  G6L-1F-DC4.5  [G6L-1F-DC4.5]
K107  G6L-1F-DC4.5  [G6L-1F-DC4.5]
K108  G6L-1F-DC4.5  [G6L-1F-DC4.5]
K109  G6L-1F-DC4.5  [G6L-1F-DC4.5]
K110  G6L-1F-DC4.5  [G6L-1F-DC4.5]
K111  G6L-1F-DC4.5  [G6L-1F-DC4.5]
K112  G6L-1F-DC4.5  [G6L-1F-DC4.5]
K113  G6L-1F-DC4.5  [G6L-1F-DC4.5]
K114  G6L-1F-DC4.5  [G6L-1F-DC4.5]
K115  G6L-1F-DC4.5  [G6L-1F-DC4.5]
K116  G6L-1F-DC4.5  [G6L-1F-DC4.5]
K117  G6L-1F-DC4.5  [G6L-1F-DC4.5]
K118  G6L-1F-DC4.5  [G6L-1F-DC4.5]
K119  G6L-1F-DC4.5  [G6L-1F-DC4.5]
K120  G6L-1F-DC4.5  [G6L-1F-DC4.5]
K121  G6L-1F-DC4.5  [G6L-1F-DC4.5]
K122  G6L-1F-DC4.5  [G6L-1F-DC4.5]
K123  G6L-1F-DC4.5  [G6L-1F-DC4.5]
K124  G6L-1F-DC4.5  [G6L-1F-DC4.5]
K125  G6L-1F-DC4.5  [G6L-1F-DC4.5]
K126  G6L-1F-DC4.5  [G6L-1F-DC4.5]
K127  G6L-1F-DC4.5  [G6L-1F-DC4.5]

### Nets
GND: K0.8(COIL_LOW) K1.8(COIL_LOW) K2.8(COIL_LOW) K3.8(COIL_LOW) K4.8(COIL_LOW) K5.8(COIL_LOW) K6.8(COIL_LOW) K7.8(COIL_LOW) K8.8(COIL_LOW) K9.8(COIL_LOW) K10.8(COIL_LOW) K11.8(COIL_LOW) K12.8(COIL_LOW) K13.8(COIL_LOW) K14.8(COIL_LOW) K15.8(COIL_LOW) K16.8(COIL_LOW) K17.8(COIL_LOW) K18.8(COIL_LOW) K19.8(COIL_LOW) K20.8(COIL_LOW) K21.8(COIL_LOW) K22.8(COIL_LOW) K23.8(COIL_LOW) K24.8(COIL_LOW) K25.8(COIL_LOW) K26.8(COIL_LOW) K27.8(COIL_LOW) K28.8(COIL_LOW) K29.8(COIL_LOW) K30.8(COIL_LOW) K31.8(COIL_LOW) K32.8(COIL_LOW) K33.8(COIL_LOW) K34.8(COIL_LOW) K35.8(COIL_LOW) K36.8(COIL_LOW) K37.8(COIL_LOW) K38.8(COIL_LOW) K39.8(COIL_LOW) K40.8(COIL_LOW) K41.8(COIL_LOW) K42.8(COIL_LOW) K43.8(COIL_LOW) K44.8(COIL_LOW) K45.8(COIL_LOW) K46.8(COIL_LOW) K47.8(COIL_LOW) K48.8(COIL_LOW) K49.8(COIL_LOW) K50.8(COIL_LOW) K51.8(COIL_LOW) K52.8(COIL_LOW) K53.8(COIL_LOW) K54.8(COIL_LOW) K55.8(COIL_LOW) K56.8(COIL_LOW) K57.8(COIL_LOW) K58.8(COIL_LOW) K59.8(COIL_LOW) K60.8(COIL_LOW) K61.8(COIL_LOW) K62.8(COIL_LOW) K63.8(COIL_LOW) K64.8(COIL_LOW) K65.8(COIL_LOW) K66.8(COIL_LOW) K67.8(COIL_LOW) K68.8(COIL_LOW) K69.8(COIL_LOW) K70.8(COIL_LOW) K71.8(COIL_LOW) K72.8(COIL_LOW) K73.8(COIL_LOW) K74.8(COIL_LOW) K75.8(COIL_LOW) K76.8(COIL_LOW) K77.8(COIL_LOW) K78.8(COIL_LOW) K79.8(COIL_LOW) K80.8(COIL_LOW) K81.8(COIL_LOW) K82.8(COIL_LOW) K83.8(COIL_LOW) K84.8(COIL_LOW) K85.8(COIL_LOW) K86.8(COIL_LOW) K87.8(COIL_LOW) K88.8(COIL_LOW) K89.8(COIL_LOW) K90.8(COIL_LOW) K91.8(COIL_LOW) K92.8(COIL_LOW) K93.8(COIL_LOW) K94.8(COIL_LOW) K95.8(COIL_LOW) K96.8(COIL_LOW) K97.8(COIL_LOW) K98.8(COIL_LOW) K99.8(COIL_LOW) K100.8(COIL_LOW) K101.8(COIL_LOW) K102.8(COIL_LOW) K103.8(COIL_LOW) K104.8(COIL_LOW) K105.8(COIL_LOW) K106.8(COIL_LOW) K107.8(COIL_LOW) K108.8(COIL_LOW) K109.8(COIL_LOW) K110.8(COIL_LOW) K111.8(COIL_LOW) K112.8(COIL_LOW) K113.8(COIL_LOW) K114.8(COIL_LOW) K115.8(COIL_LOW) K116.8(COIL_LOW) K117.8(COIL_LOW) K118.8(COIL_LOW) K119.8(COIL_LOW) K120.8(COIL_LOW) K121.8(COIL_LOW) K122.8(COIL_LOW) K123.8(COIL_LOW) K124.8(COIL_LOW) K125.8(COIL_LOW) K126.8(COIL_LOW) K127.8(COIL_LOW) ; also sheet 1,2,3,5
IN0: K0.4(SIG_IN) K1.4(SIG_IN) K2.4(SIG_IN) K3.4(SIG_IN) K4.4(SIG_IN) K5.4(SIG_IN) K6.4(SIG_IN) K7.4(SIG_IN) ; also sheet 6
IN1: K8.4(SIG_IN) K9.4(SIG_IN) K10.4(SIG_IN) K11.4(SIG_IN) K12.4(SIG_IN) K13.4(SIG_IN) K14.4(SIG_IN) K15.4(SIG_IN) ; also sheet 6
IN2: K16.4(SIG_IN) K17.4(SIG_IN) K18.4(SIG_IN) K19.4(SIG_IN) K20.4(SIG_IN) K21.4(SIG_IN) K22.4(SIG_IN) K23.4(SIG_IN) ; also sheet 6
IN3: K24.4(SIG_IN) K25.4(SIG_IN) K26.4(SIG_IN) K27.4(SIG_IN) K28.4(SIG_IN) K29.4(SIG_IN) K30.4(SIG_IN) K31.4(SIG_IN) ; also sheet 6
IN4: K32.4(SIG_IN) K33.4(SIG_IN) K34.4(SIG_IN) K35.4(SIG_IN) K36.4(SIG_IN) K37.4(SIG_IN) K38.4(SIG_IN) K39.4(SIG_IN) ; also sheet 6
IN5: K40.4(SIG_IN) K41.4(SIG_IN) K42.4(SIG_IN) K43.4(SIG_IN) K44.4(SIG_IN) K45.4(SIG_IN) K46.4(SIG_IN) K47.4(SIG_IN) ; also sheet 6
IN6: K48.4(SIG_IN) K49.4(SIG_IN) K50.4(SIG_IN) K51.4(SIG_IN) K52.4(SIG_IN) K53.4(SIG_IN) K54.4(SIG_IN) K55.4(SIG_IN) ; also sheet 6
IN7: K56.4(SIG_IN) K57.4(SIG_IN) K58.4(SIG_IN) K59.4(SIG_IN) K60.4(SIG_IN) K61.4(SIG_IN) K62.4(SIG_IN) K63.4(SIG_IN) ; also sheet 6
IN8: K64.4(SIG_IN) K65.4(SIG_IN) K66.4(SIG_IN) K67.4(SIG_IN) K68.4(SIG_IN) K69.4(SIG_IN) K70.4(SIG_IN) K71.4(SIG_IN) ; also sheet 6
IN9: K72.4(SIG_IN) K73.4(SIG_IN) K74.4(SIG_IN) K75.4(SIG_IN) K76.4(SIG_IN) K77.4(SIG_IN) K78.4(SIG_IN) K79.4(SIG_IN) ; also sheet 6
IN10: K80.4(SIG_IN) K81.4(SIG_IN) K82.4(SIG_IN) K83.4(SIG_IN) K84.4(SIG_IN) K85.4(SIG_IN) K86.4(SIG_IN) K87.4(SIG_IN) ; also sheet 6
IN11: K88.4(SIG_IN) K89.4(SIG_IN) K90.4(SIG_IN) K91.4(SIG_IN) K92.4(SIG_IN) K93.4(SIG_IN) K94.4(SIG_IN) K95.4(SIG_IN) ; also sheet 6
IN12: K96.4(SIG_IN) K97.4(SIG_IN) K98.4(SIG_IN) K99.4(SIG_IN) K100.4(SIG_IN) K101.4(SIG_IN) K102.4(SIG_IN) K103.4(SIG_IN) ; also sheet 6
IN13: K104.4(SIG_IN) K105.4(SIG_IN) K106.4(SIG_IN) K107.4(SIG_IN) K108.4(SIG_IN) K109.4(SIG_IN) K110.4(SIG_IN) K111.4(SIG_IN) ; also sheet 6
IN14: K112.4(SIG_IN) K113.4(SIG_IN) K114.4(SIG_IN) K115.4(SIG_IN) K116.4(SIG_IN) K117.4(SIG_IN) K118.4(SIG_IN) K119.4(SIG_IN) ; also sheet 6
IN15: K120.4(SIG_IN) K121.4(SIG_IN) K122.4(SIG_IN) K123.4(SIG_IN) K124.4(SIG_IN) K125.4(SIG_IN) K126.4(SIG_IN) K127.4(SIG_IN) ; also sheet 6
OUT0: K0.2(SIG_OUT) K8.2(SIG_OUT) K16.2(SIG_OUT) K24.2(SIG_OUT) K32.2(SIG_OUT) K40.2(SIG_OUT) K48.2(SIG_OUT) K56.2(SIG_OUT) K64.2(SIG_OUT) K72.2(SIG_OUT) K80.2(SIG_OUT) K88.2(SIG_OUT) K96.2(SIG_OUT) K104.2(SIG_OUT) K112.2(SIG_OUT) K120.2(SIG_OUT) ; also sheet 6
OUT1: K1.2(SIG_OUT) K9.2(SIG_OUT) K17.2(SIG_OUT) K25.2(SIG_OUT) K33.2(SIG_OUT) K41.2(SIG_OUT) K49.2(SIG_OUT) K57.2(SIG_OUT) K65.2(SIG_OUT) K73.2(SIG_OUT) K81.2(SIG_OUT) K89.2(SIG_OUT) K97.2(SIG_OUT) K105.2(SIG_OUT) K113.2(SIG_OUT) K121.2(SIG_OUT) ; also sheet 6
OUT2: K2.2(SIG_OUT) K10.2(SIG_OUT) K18.2(SIG_OUT) K26.2(SIG_OUT) K34.2(SIG_OUT) K42.2(SIG_OUT) K50.2(SIG_OUT) K58.2(SIG_OUT) K66.2(SIG_OUT) K74.2(SIG_OUT) K82.2(SIG_OUT) K90.2(SIG_OUT) K98.2(SIG_OUT) K106.2(SIG_OUT) K114.2(SIG_OUT) K122.2(SIG_OUT) ; also sheet 6
OUT3: K3.2(SIG_OUT) K11.2(SIG_OUT) K19.2(SIG_OUT) K27.2(SIG_OUT) K35.2(SIG_OUT) K43.2(SIG_OUT) K51.2(SIG_OUT) K59.2(SIG_OUT) K67.2(SIG_OUT) K75.2(SIG_OUT) K83.2(SIG_OUT) K91.2(SIG_OUT) K99.2(SIG_OUT) K107.2(SIG_OUT) K115.2(SIG_OUT) K123.2(SIG_OUT) ; also sheet 6
OUT4: K4.2(SIG_OUT) K12.2(SIG_OUT) K20.2(SIG_OUT) K28.2(SIG_OUT) K36.2(SIG_OUT) K44.2(SIG_OUT) K52.2(SIG_OUT) K60.2(SIG_OUT) K68.2(SIG_OUT) K76.2(SIG_OUT) K84.2(SIG_OUT) K92.2(SIG_OUT) K100.2(SIG_OUT) K108.2(SIG_OUT) K116.2(SIG_OUT) K124.2(SIG_OUT) ; also sheet 6
OUT5: K5.2(SIG_OUT) K13.2(SIG_OUT) K21.2(SIG_OUT) K29.2(SIG_OUT) K37.2(SIG_OUT) K45.2(SIG_OUT) K53.2(SIG_OUT) K61.2(SIG_OUT) K69.2(SIG_OUT) K77.2(SIG_OUT) K85.2(SIG_OUT) K93.2(SIG_OUT) K101.2(SIG_OUT) K109.2(SIG_OUT) K117.2(SIG_OUT) K125.2(SIG_OUT) ; also sheet 6
OUT6: K6.2(SIG_OUT) K14.2(SIG_OUT) K22.2(SIG_OUT) K30.2(SIG_OUT) K38.2(SIG_OUT) K46.2(SIG_OUT) K54.2(SIG_OUT) K62.2(SIG_OUT) K70.2(SIG_OUT) K78.2(SIG_OUT) K86.2(SIG_OUT) K94.2(SIG_OUT) K102.2(SIG_OUT) K110.2(SIG_OUT) K118.2(SIG_OUT) K126.2(SIG_OUT) ; also sheet 6
OUT7: K7.2(SIG_OUT) K15.2(SIG_OUT) K23.2(SIG_OUT) K31.2(SIG_OUT) K39.2(SIG_OUT) K47.2(SIG_OUT) K55.2(SIG_OUT) K63.2(SIG_OUT) K71.2(SIG_OUT) K79.2(SIG_OUT) K87.2(SIG_OUT) K95.2(SIG_OUT) K103.2(SIG_OUT) K111.2(SIG_OUT) K119.2(SIG_OUT) K127.2(SIG_OUT) ; also sheet 6
R0: K0.5(COIL_HIGH) ; also sheet 3
R1: K1.5(COIL_HIGH) ; also sheet 3
R2: K2.5(COIL_HIGH) ; also sheet 3
R3: K3.5(COIL_HIGH) ; also sheet 3
R4: K4.5(COIL_HIGH) ; also sheet 3
R5: K5.5(COIL_HIGH) ; also sheet 3
R6: K6.5(COIL_HIGH) ; also sheet 3
R7: K7.5(COIL_HIGH) ; also sheet 3
R8: K8.5(COIL_HIGH) ; also sheet 3
R9: K9.5(COIL_HIGH) ; also sheet 3
R10: K10.5(COIL_HIGH) ; also sheet 3
R11: K11.5(COIL_HIGH) ; also sheet 3
R12: K12.5(COIL_HIGH) ; also sheet 3
R13: K13.5(COIL_HIGH) ; also sheet 3
R14: K14.5(COIL_HIGH) ; also sheet 3
R15: K15.5(COIL_HIGH) ; also sheet 3
R16: K16.5(COIL_HIGH) ; also sheet 3
R17: K17.5(COIL_HIGH) ; also sheet 3
R18: K18.5(COIL_HIGH) ; also sheet 3
R19: K19.5(COIL_HIGH) ; also sheet 3
R20: K20.5(COIL_HIGH) ; also sheet 3
R21: K21.5(COIL_HIGH) ; also sheet 3
R22: K22.5(COIL_HIGH) ; also sheet 3
R23: K23.5(COIL_HIGH) ; also sheet 3
R24: K24.5(COIL_HIGH) ; also sheet 3
R25: K25.5(COIL_HIGH) ; also sheet 3
R26: K26.5(COIL_HIGH) ; also sheet 3
R27: K27.5(COIL_HIGH) ; also sheet 3
R28: K28.5(COIL_HIGH) ; also sheet 3
R29: K29.5(COIL_HIGH) ; also sheet 3
R30: K30.5(COIL_HIGH) ; also sheet 3
R31: K31.5(COIL_HIGH) ; also sheet 3
R32: K32.5(COIL_HIGH) ; also sheet 3
R33: K33.5(COIL_HIGH) ; also sheet 3
R34: K34.5(COIL_HIGH) ; also sheet 3
R35: K35.5(COIL_HIGH) ; also sheet 3
R36: K36.5(COIL_HIGH) ; also sheet 3
R37: K37.5(COIL_HIGH) ; also sheet 3
R38: K38.5(COIL_HIGH) ; also sheet 3
R39: K39.5(COIL_HIGH) ; also sheet 3
R40: K40.5(COIL_HIGH) ; also sheet 3
R41: K41.5(COIL_HIGH) ; also sheet 3
R42: K42.5(COIL_HIGH) ; also sheet 3
R43: K43.5(COIL_HIGH) ; also sheet 3
R44: K44.5(COIL_HIGH) ; also sheet 3
R45: K45.5(COIL_HIGH) ; also sheet 3
R46: K46.5(COIL_HIGH) ; also sheet 3
R47: K47.5(COIL_HIGH) ; also sheet 3
R48: K48.5(COIL_HIGH) ; also sheet 3
R49: K49.5(COIL_HIGH) ; also sheet 3
R50: K50.5(COIL_HIGH) ; also sheet 3
R51: K51.5(COIL_HIGH) ; also sheet 3
R52: K52.5(COIL_HIGH) ; also sheet 3
R53: K53.5(COIL_HIGH) ; also sheet 3
R54: K54.5(COIL_HIGH) ; also sheet 3
R55: K55.5(COIL_HIGH) ; also sheet 3
R56: K56.5(COIL_HIGH) ; also sheet 3
R57: K57.5(COIL_HIGH) ; also sheet 3
R58: K58.5(COIL_HIGH) ; also sheet 3
R59: K59.5(COIL_HIGH) ; also sheet 3
R60: K60.5(COIL_HIGH) ; also sheet 3
R61: K61.5(COIL_HIGH) ; also sheet 3
R62: K62.5(COIL_HIGH) ; also sheet 3
R63: K63.5(COIL_HIGH) ; also sheet 3
R64: K64.5(COIL_HIGH) ; also sheet 3
R65: K65.5(COIL_HIGH) ; also sheet 3
R66: K66.5(COIL_HIGH) ; also sheet 3
R67: K67.5(COIL_HIGH) ; also sheet 3
R68: K68.5(COIL_HIGH) ; also sheet 3
R69: K69.5(COIL_HIGH) ; also sheet 3
R70: K70.5(COIL_HIGH) ; also sheet 3
R71: K71.5(COIL_HIGH) ; also sheet 3
R72: K72.5(COIL_HIGH) ; also sheet 3
R73: K73.5(COIL_HIGH) ; also sheet 3
R74: K74.5(COIL_HIGH) ; also sheet 3
R75: K75.5(COIL_HIGH) ; also sheet 3
R76: K76.5(COIL_HIGH) ; also sheet 3
R77: K77.5(COIL_HIGH) ; also sheet 3
R78: K78.5(COIL_HIGH) ; also sheet 3
R79: K79.5(COIL_HIGH) ; also sheet 3
R80: K80.5(COIL_HIGH) ; also sheet 3
R81: K81.5(COIL_HIGH) ; also sheet 3
R82: K82.5(COIL_HIGH) ; also sheet 3
R83: K83.5(COIL_HIGH) ; also sheet 3
R84: K84.5(COIL_HIGH) ; also sheet 3
R85: K85.5(COIL_HIGH) ; also sheet 3
R86: K86.5(COIL_HIGH) ; also sheet 3
R87: K87.5(COIL_HIGH) ; also sheet 3
R88: K88.5(COIL_HIGH) ; also sheet 3
R89: K89.5(COIL_HIGH) ; also sheet 3
R90: K90.5(COIL_HIGH) ; also sheet 3
R91: K91.5(COIL_HIGH) ; also sheet 3
R92: K92.5(COIL_HIGH) ; also sheet 3
R93: K93.5(COIL_HIGH) ; also sheet 3
R94: K94.5(COIL_HIGH) ; also sheet 3
R95: K95.5(COIL_HIGH) ; also sheet 3
R96: K96.5(COIL_HIGH) ; also sheet 3
R97: K97.5(COIL_HIGH) ; also sheet 3
R98: K98.5(COIL_HIGH) ; also sheet 3
R99: K99.5(COIL_HIGH) ; also sheet 3
R100: K100.5(COIL_HIGH) ; also sheet 3
R101: K101.5(COIL_HIGH) ; also sheet 3
R102: K102.5(COIL_HIGH) ; also sheet 3
R103: K103.5(COIL_HIGH) ; also sheet 3
R104: K104.5(COIL_HIGH) ; also sheet 3
R105: K105.5(COIL_HIGH) ; also sheet 3
R106: K106.5(COIL_HIGH) ; also sheet 3
R107: K107.5(COIL_HIGH) ; also sheet 3
R108: K108.5(COIL_HIGH) ; also sheet 3
R109: K109.5(COIL_HIGH) ; also sheet 3
R110: K110.5(COIL_HIGH) ; also sheet 3
R111: K111.5(COIL_HIGH) ; also sheet 3
R112: K112.5(COIL_HIGH) ; also sheet 3
R113: K113.5(COIL_HIGH) ; also sheet 3
R114: K114.5(COIL_HIGH) ; also sheet 3
R115: K115.5(COIL_HIGH) ; also sheet 3
R116: K116.5(COIL_HIGH) ; also sheet 3
R117: K117.5(COIL_HIGH) ; also sheet 3
R118: K118.5(COIL_HIGH) ; also sheet 3
R119: K119.5(COIL_HIGH) ; also sheet 3
R120: K120.5(COIL_HIGH) ; also sheet 3
R121: K121.5(COIL_HIGH) ; also sheet 3
R122: K122.5(COIL_HIGH) ; also sheet 3
R123: K123.5(COIL_HIGH) ; also sheet 3
R124: K124.5(COIL_HIGH) ; also sheet 3
R125: K125.5(COIL_HIGH) ; also sheet 3
R126: K126.5(COIL_HIGH) ; also sheet 3
R127: K127.5(COIL_HIGH) ; also sheet 3

### Notes on the sheet
- 0 | 1 | 2 | 3 | 4 | 5 | 6 | 13 | 14 | 15
- 7 | 8 | 9 | 10 | 11 | 12
- 0 | 0
- 1 | 1
- 2 | 2
- 3
- 3
- 4
- 4
- 5 | 5
- 6
- 6
- 7
- 7
- 0 | 1 | 2 | 3 | 4 | 5 | 11 | 12
- 6 | 7 | 8 | 9 | 10 | 13 | 14 | 15

## Sheet 5 of 6
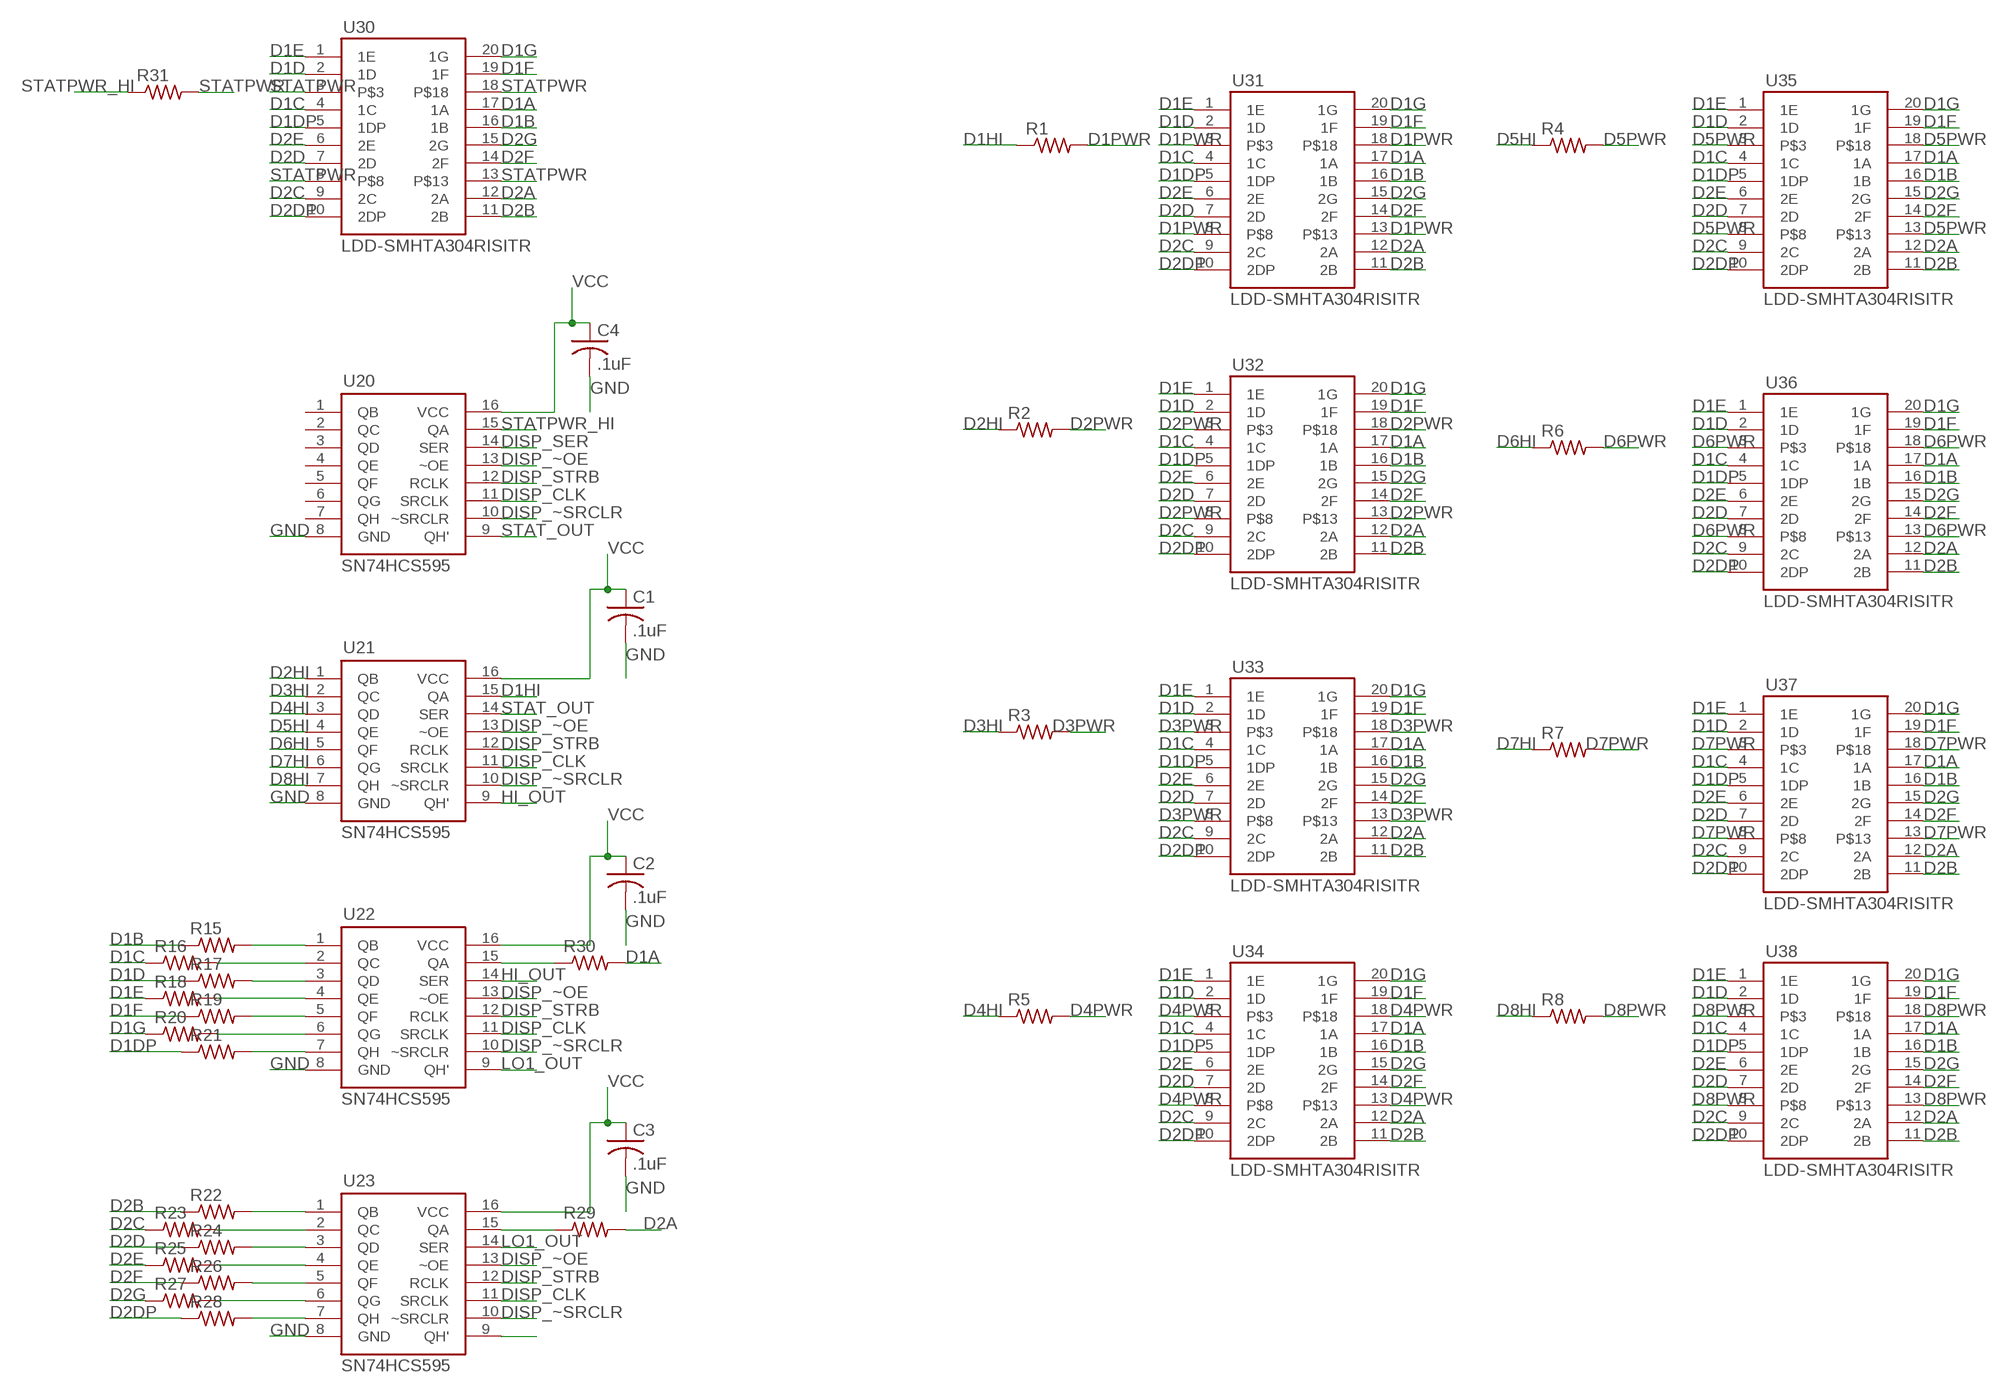
[diagram p5: schematic, sheet 5]

### Parts
C1  .1uF  C-USC0402  [C0402]
C2  .1uF  C-USC0402  [C0402]
C3  .1uF  C-USC0402  [C0402]
C4  .1uF  C-USC0402  [C0402]
R1  R-US_R0402  [R0402]
R2  R-US_R0402  [R0402]
R3  R-US_R0402  [R0402]
R4  R-US_R0402  [R0402]
R5  R-US_R0402  [R0402]
R6  R-US_R0402  [R0402]
R7  R-US_R0402  [R0402]
R8  R-US_R0402  [R0402]
R15  R-US_R0402  [R0402]
R16  R-US_R0402  [R0402]
R17  R-US_R0402  [R0402]
R18  R-US_R0402  [R0402]
R19  R-US_R0402  [R0402]
R20  R-US_R0402  [R0402]
R21  R-US_R0402  [R0402]
R22  R-US_R0402  [R0402]
R23  R-US_R0402  [R0402]
R24  R-US_R0402  [R0402]
R25  R-US_R0402  [R0402]
R26  R-US_R0402  [R0402]
R27  R-US_R0402  [R0402]
R28  R-US_R0402  [R0402]
R29  R-US_R0402  [R0402]
R30  R-US_R0402  [R0402]
R31  R-US_R0402  [R0402]
U20  SN74HCS595  [SOP65P640X120-16N]
U21  SN74HCS595  [SOP65P640X120-16N]
U22  SN74HCS595  [SOP65P640X120-16N]
U23  SN74HCS595  [SOP65P640X120-16N]
U30  LDD-SMHTA304RISITR  [LDD-SMHTA304RISITR-20DFN]
U31  LDD-SMHTA304RISITR  [LDD-SMHTA304RISITR-20DFN]
U32  LDD-SMHTA304RISITR  [LDD-SMHTA304RISITR-20DFN]
U33  LDD-SMHTA304RISITR  [LDD-SMHTA304RISITR-20DFN]
U34  LDD-SMHTA304RISITR  [LDD-SMHTA304RISITR-20DFN]
U35  LDD-SMHTA304RISITR  [LDD-SMHTA304RISITR-20DFN]
U36  LDD-SMHTA304RISITR  [LDD-SMHTA304RISITR-20DFN]
U37  LDD-SMHTA304RISITR  [LDD-SMHTA304RISITR-20DFN]
U38  LDD-SMHTA304RISITR  [LDD-SMHTA304RISITR-20DFN]

### Nets
D1A: R30.2 U30.17(1A) U31.17(1A) U32.17(1A) U33.17(1A) U34.17(1A) U35.17(1A) U36.17(1A) U37.17(1A) U38.17(1A)
D1B: R15.1 U30.16(1B) U31.16(1B) U32.16(1B) U33.16(1B) U34.16(1B) U35.16(1B) U36.16(1B) U37.16(1B) U38.16(1B)
D1C: R16.1 U30.4(1C) U31.4(1C) U32.4(1C) U33.4(1C) U34.4(1C) U35.4(1C) U36.4(1C) U37.4(1C) U38.4(1C)
D1D: R17.1 U30.2(1D) U31.2(1D) U32.2(1D) U33.2(1D) U34.2(1D) U35.2(1D) U36.2(1D) U37.2(1D) U38.2(1D)
D1DP: R21.1 U30.5(1DP) U31.5(1DP) U32.5(1DP) U33.5(1DP) U34.5(1DP) U35.5(1DP) U36.5(1DP) U37.5(1DP) U38.5(1DP)
D1E: R18.1 U30.1(1E) U31.1(1E) U32.1(1E) U33.1(1E) U34.1(1E) U35.1(1E) U36.1(1E) U37.1(1E) U38.1(1E)
D1F: R19.1 U30.19(1F) U31.19(1F) U32.19(1F) U33.19(1F) U34.19(1F) U35.19(1F) U36.19(1F) U37.19(1F) U38.19(1F)
D1G: R20.1 U30.20(1G) U31.20(1G) U32.20(1G) U33.20(1G) U34.20(1G) U35.20(1G) U36.20(1G) U37.20(1G) U38.20(1G)
D1HI: R1.1 U21.15(QA)
D1PWR: R1.2 U31.3 U31.8 U31.13 U31.18
D2A: R29.2 U30.12(2A) U31.12(2A) U32.12(2A) U33.12(2A) U34.12(2A) U35.12(2A) U36.12(2A) U37.12(2A) U38.12(2A)
D2B: R22.1 U30.11(2B) U31.11(2B) U32.11(2B) U33.11(2B) U34.11(2B) U35.11(2B) U36.11(2B) U37.11(2B) U38.11(2B)
D2C: R23.1 U30.9(2C) U31.9(2C) U32.9(2C) U33.9(2C) U34.9(2C) U35.9(2C) U36.9(2C) U37.9(2C) U38.9(2C)
D2D: R24.1 U30.7(2D) U31.7(2D) U32.7(2D) U33.7(2D) U34.7(2D) U35.7(2D) U36.7(2D) U37.7(2D) U38.7(2D)
D2DP: R28.1 U30.10(2DP) U31.10(2DP) U32.10(2DP) U33.10(2DP) U34.10(2DP) U35.10(2DP) U36.10(2DP) U37.10(2DP) U38.10(2DP)
D2E: R25.1 U30.6(2E) U31.6(2E) U32.6(2E) U33.6(2E) U34.6(2E) U35.6(2E) U36.6(2E) U37.6(2E) U38.6(2E)
D2F: R26.1 U30.14(2F) U31.14(2F) U32.14(2F) U33.14(2F) U34.14(2F) U35.14(2F) U36.14(2F) U37.14(2F) U38.14(2F)
D2G: R27.1 U30.15(2G) U31.15(2G) U32.15(2G) U33.15(2G) U34.15(2G) U35.15(2G) U36.15(2G) U37.15(2G) U38.15(2G)
D2HI: R2.1 U21.1(QB)
D2PWR: R2.2 U32.3 U32.8 U32.13 U32.18
D3HI: R3.1 U21.2(QC)
D3PWR: R3.2 U33.3 U33.8 U33.13 U33.18
D4HI: R5.1 U21.3(QD)
D4PWR: R5.2 U34.3 U34.8 U34.13 U34.18
D5HI: R4.1 U21.4(QE)
D5PWR: R4.2 U35.3 U35.8 U35.13 U35.18
D6HI: R6.1 U21.5(QF)
D6PWR: R6.2 U36.3 U36.8 U36.13 U36.18
D7HI: R7.1 U21.6(QG)
D7PWR: R7.2 U37.3 U37.8 U37.13 U37.18
D8HI: R8.1 U21.7(QH)
D8PWR: R8.2 U38.3 U38.8 U38.13 U38.18
DISP_CLK: U20.11(SRCLK) U21.11(SRCLK) U22.11(SRCLK) U23.11(SRCLK) ; also sheet 1
DISP_SER: U20.14(SER) ; also sheet 1
DISP_STRB: U20.12(RCLK) U21.12(RCLK) U22.12(RCLK) U23.12(RCLK) ; also sheet 1
DISP_~OE: U20.13(~OE) U21.13(~OE) U22.13(~OE) U23.13(~OE) ; also sheet 1
DISP_~SRCLR: U20.10(~SRCLR) U21.10(~SRCLR) U22.10(~SRCLR) U23.10(~SRCLR) ; also sheet 1
GND: C1.2 C2.2 C3.2 C4.2 U20.8(GND) U21.8(GND) U22.8(GND) U23.8(GND) ; also sheet 1,2,3,4
HI_OUT: U21.9(QH') U22.14(SER)
LO1_OUT: U22.9(QH') U23.14(SER)
N$2: R30.1 U22.15(QA)
N$3: R22.2 U23.1(QB)
N$6: R15.2 U22.1(QB)
N$7: R23.2 U23.2(QC)
N$8: R24.2 U23.3(QD)
N$9: R16.2 U22.2(QC)
N$10: R17.2 U22.3(QD)
N$11: R18.2 U22.4(QE)
N$12: R19.2 U22.5(QF)
N$13: R20.2 U22.6(QG)
N$14: R21.2 U22.7(QH)
N$15: R25.2 U23.4(QE)
N$16: R26.2 U23.5(QF)
N$17: R27.2 U23.6(QG)
N$18: R28.2 U23.7(QH)
N$27: R29.1 U23.15(QA)
N$29: U23.9(QH')
STAT_OUT: U20.9(QH') U21.14(SER)
STATPWR: R31.2 U30.3 U30.8 U30.13 U30.18
STATPWR_HI: R31.1 U20.15(QA)
VCC: C1.1 C2.1 C3.1 C4.1 U20.16(VCC) U21.16(VCC) U22.16(VCC) U23.16(VCC) ; also sheet 1,2,3
Unconnected: U20.1(QB) U20.2(QC) U20.3(QD) U20.4(QE) U20.5(QF) U20.6(QG) U20.7(QH)

## Sheet 6 of 6
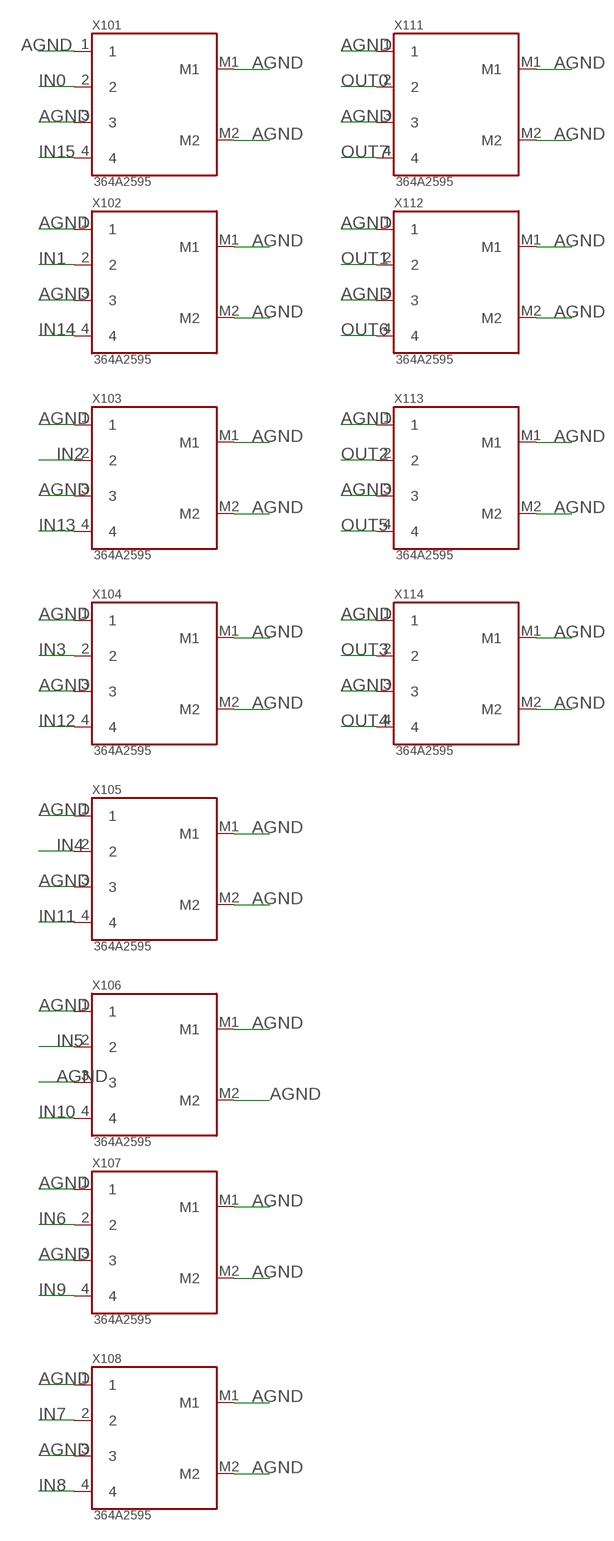
[diagram p6: schematic, sheet 6]

### Parts
X101  364A2595  [364A2595]
X102  364A2595  [364A2595]
X103  364A2595  [364A2595]
X104  364A2595  [364A2595]
X105  364A2595  [364A2595]
X106  364A2595  [364A2595]
X107  364A2595  [364A2595]
X108  364A2595  [364A2595]
X111  364A2595  [364A2595]
X112  364A2595  [364A2595]
X113  364A2595  [364A2595]
X114  364A2595  [364A2595]

### Nets
AGND: X101.1 X101.3 X101.M1 X101.M2 X102.1 X102.3 X102.M1 X102.M2 X103.1 X103.3 X103.M1 X103.M2 X104.1 X104.3 X104.M1 X104.M2 X105.1 X105.3 X105.M1 X105.M2 X106.1 X106.3 X106.M1 X106.M2 X107.1 X107.3 X107.M1 X107.M2 X108.1 X108.3 X108.M1 X108.M2 X111.1 X111.3 X111.M1 X111.M2 X112.1 X112.3 X112.M1 X112.M2 X113.1 X113.3 X113.M1 X113.M2 X114.1 X114.3 X114.M1 X114.M2 ; also sheet 2
IN0: X101.2 ; also sheet 4
IN1: X102.2 ; also sheet 4
IN2: X103.2 ; also sheet 4
IN3: X104.2 ; also sheet 4
IN4: X105.2 ; also sheet 4
IN5: X106.2 ; also sheet 4
IN6: X107.2 ; also sheet 4
IN7: X108.2 ; also sheet 4
IN8: X108.4 ; also sheet 4
IN9: X107.4 ; also sheet 4
IN10: X106.4 ; also sheet 4
IN11: X105.4 ; also sheet 4
IN12: X104.4 ; also sheet 4
IN13: X103.4 ; also sheet 4
IN14: X102.4 ; also sheet 4
IN15: X101.4 ; also sheet 4
OUT0: X111.2 ; also sheet 4
OUT1: X112.2 ; also sheet 4
OUT2: X113.2 ; also sheet 4
OUT3: X114.2 ; also sheet 4
OUT4: X114.4 ; also sheet 4
OUT5: X113.4 ; also sheet 4
OUT6: X112.4 ; also sheet 4
OUT7: X111.4 ; also sheet 4

## Power pins joined to a net without a drawn wire
VBAT: U1.37(VBAT)

## Library data of the parts
C1-C4 C46 C47 C101 C102 C106 C107 C109 = resistor:C-US: CAPACITOR, American symbol; MANUFACTURER_PART_NUMBER: CL05B104KO5NNNC; MFR_NAME: Samsung Electro-Mechanics
C5 = resistor:C-US: CAPACITOR, American symbol; MANUFACTURER_PART_NUMBER: CL10A475KA8NQNC; MFR_NAME: Samsung Electro-Mechanics
C6 C8 C9 C14-C45 C105 C110 = resistor:C-US: CAPACITOR, American symbol; MANUFACTURER_PART_NUMBER: CL05A105KO5NNNC; MFR_NAME: Samsung Electro-Mechanics
C7 C10-C12 = rcl:C-US: CAPACITOR, American symbol; MANUFACTURER_PART_NUMBER: CL21A106KAYNNNE; MFR_NAME: Samsung Electro-Mechanics; SPICEPREFIX: C
C13 C103 C104 = resistor:C-US: CAPACITOR, American symbol; MANUFACTURER_PART_NUMBER: GCM155R71H103KA55D; MFR_NAME: Murata Electronics
C108 = resistor:C-US: CAPACITOR, American symbol; MANUFACTURER_PART_NUMBER: CL10A225KO8NNNC; MFR_NAME: Samsung Electro-Mechanics
D1 D2 = XZCBD53W-8:XZCBD53W-8
J6-J8 = CT3151:CT3151; COPYRIGHT: Copyright (C) 2021 Ultra Librarian. All rights reserved.; MANUFACTURER_PART_NUMBER: CT3151SP-9; MFR_NAME: CAL TEST ELECTRONICS
K0 K1-K127 = G6L-1F-DC4.5:G6L-1F-DC4.5; MANUFACTURER_PART_NUMBER: G6L-1F-DC4.5; MFR_NAME: Omron Electronics Inc-EMC Div
R1-R8 R15-R31 = resistor:R-US_: RESISTOR, American symbol
R9 = resistor:R-US_: RESISTOR, American symbol; MANUFACTURER_PART_NUMBER: CRG0402F1K0; MFR_NAME: TE Connectivity Passive Product
R10 R11 = resistor:R-US_: RESISTOR, American symbol; MANUFACTURER_PART_NUMBER: RC0402FR-075K1L; MFR_NAME: YAGEO
R12 = resistor:R-US_: RESISTOR, American symbol; MANUFACTURER_PART_NUMBER: RMCF0402FT47K5; MFR_NAME: Stackpole Electronics Inc
R13 = resistor:R-US_: RESISTOR, American symbol; MANUFACTURER_PART_NUMBER: RC0402FR-0722K1L; MFR_NAME: YAGEO
R14 = resistor:R-US_: RESISTOR, American symbol; MANUFACTURER_PART_NUMBER: RC1005F103CS; MFR_NAME: Samsung Electro-Mechanics
R32 = resistor:R-US_: RESISTOR, American symbol; MANUFACTURER_PART_NUMBER: RC0402JR-07470RL; MFR_NAME: YAGEO
R33 R35 = rcl:R-US_: RESISTOR, American symbol; MANUFACTURER_PART_NUMBER: RC1608F221CS; MFR_NAME: Samsung Electro-Mechanics; SPICEPREFIX: R
R34 = rcl:R-US_: RESISTOR, American symbol; MANUFACTURER_PART_NUMBER: RC0603FR-07360RL; MFR_NAME: YAGEO; SPICEPREFIX: R
R36 = rcl:R-US_: RESISTOR, American symbol; MANUFACTURER_PART_NUMBER: RC0603FR-07680RL; MFR_NAME: YAGEO; SPICEPREFIX: R
R37 R38 = rcl:R-US_: RESISTOR, American symbol; MANUFACTURER_PART_NUMBER: RC0603FR-071RL; MFR_NAME: YAGEO; SPICEPREFIX: R
S1 = 100DP1T2B4M6QE:100DP1T2B4M7QE; COPYRIGHT: Copyright (C) 2021 Ultra Librarian. All rights reserved.; MANUFACTURER_PART_NUMBER: 100DP1T2B4M7QE; MFR_NAME: E-Switch
S2 = fsm4jsma:TE_FSM4JSMA: Tactile Switch OFF-MOM, Surface Mount. This is from the standard FSMJSMA switch line by TE connectivity.; MANUFACTURER_PART_NUMBER: FSM4JSMA; MFR: TE connectivity; MFR_NAME: TE Connectivity; MFR_PN: FSM4JSMA
U1 = TM4C123GH6PMI:TM4C123GH6PMI; COPYRIGHT: Copyright (C) 2021 Ultra Librarian. All rights reserved.; MANUFACTURER_PART_NUMBER: TM4C123GH6PMI; MFR_NAME: Texas Instruments; REFDES: RefDes; TYPE: TYPE
U2 = cp2102:CP2102N-A02-GQFN24R: usb-to-uart; COPYRIGHT: Copyright (C) 2021 Ultra Librarian. All rights reserved.; MANUFACTURER_PART_NUMBER: CP2102N-A02-GQFN24R; MFR_NAME: Silicon Labs
U3 U4 = 1117:NCP1117XXA; MANUFACTURER_PART_NUMBER: NCP1117IDTAT4G; MFR: on semi; MFR_NAME: ON Semiconductor; MFR_PN: NCP1117IDTAT4G
U5 = ecs-20xx:ECS-2033-080-AU; MANUFACTURER_PART_NUMBER: ECS-2033-080-AU; MFR_NAME: ECS Incorporated
U6 = TPD4E001RDBVR:TPD4E001RDBVR; COPYRIGHT: Copyright (C) 2021 Ultra Librarian. All rights reserved.; MANUFACTURER_PART_NUMBER: TPD4E001RDBVR; MFR_NAME: Texas Instruments
U20-U23 = SN74HCS595:SN74HCS595; MANUFACTURER_PART_NUMBER: SN74HCS595PWR; MFR_NAME: Texas Instruments
U30-U38 = LDD-SMHTA304RISITR:LDD-SMHTA304RISITR; MANUFACTURER_PART_NUMBER: LDD-SMHTA304RISITR; MFR_NAME: Lumex Opto/Components Inc.
U100-U115 = MIC5891YWM:MIC5891YWM-TR: 8-bit shift register/relay driver; COPYRIGHT: Copyright (C) 2021 Ultra Librarian. All rights reserved.; MANUFACTURER_PART_NUMBER: MIC5891YWM-TR; MFR_NAME: Microchip
U$131 = uart_3pin_header:3PIN_UART_HEADER
X1 = 2171790001:2171790001: usb-c surface mount jack; COPYRIGHT: Copyright (C) 2021 Ultra Librarian. All rights reserved.; MANUFACTURER_PART_NUMBER: 2171790001; MFR_NAME: Molex Connector Corporation
X2 = FTSH-105-01-F-DV-007-K-P:FTSH-105-01-F-DV-007-K-P: 10-pin, keyed, 1.27mm header for cortex SWD connections. Missing pin 7 is "key pin" space 1 -- VCC SWDIO/TMS -- 2 3 -- GND SWDCLK/TCK -- 4 5 -- GND SWO/TDO -- 6 7 -- KEY NC/TDI -- 8 9 -- GNDDETECT nRESET -- 10; MANUFACTURER_PART_NUMBER: FTSH-105-01-F-DV-007-K-P; MFR: samtec; MFR_NAME: Samtec; MFR_PN: FTSH-105-01-F-DV-007-K-P
X3-X5 = SJ1-3523NG:SJ1-3523NG: 3.5 mm Right-Angle Stereo Jack, 3 Pin PCB Mount, Isolated Ground; MANUFACTURER: CUI; MANUFACTURER_PART_NUMBER: SJ1-3523NG; MFR_NAME: CUI Devices; PARTREV: 1.01; STANDARD: Manufacturer recommendation
X101-X108 X111-X114 = 364A2595:364A2595: Dual-port right-angle BNC jack.; MANUFACTURER_PART_NUMBER: 364A2595; MFR_NAME: Winchester Interconnect